# EAGLE design RowDriver4 (EAGLE 6.3)
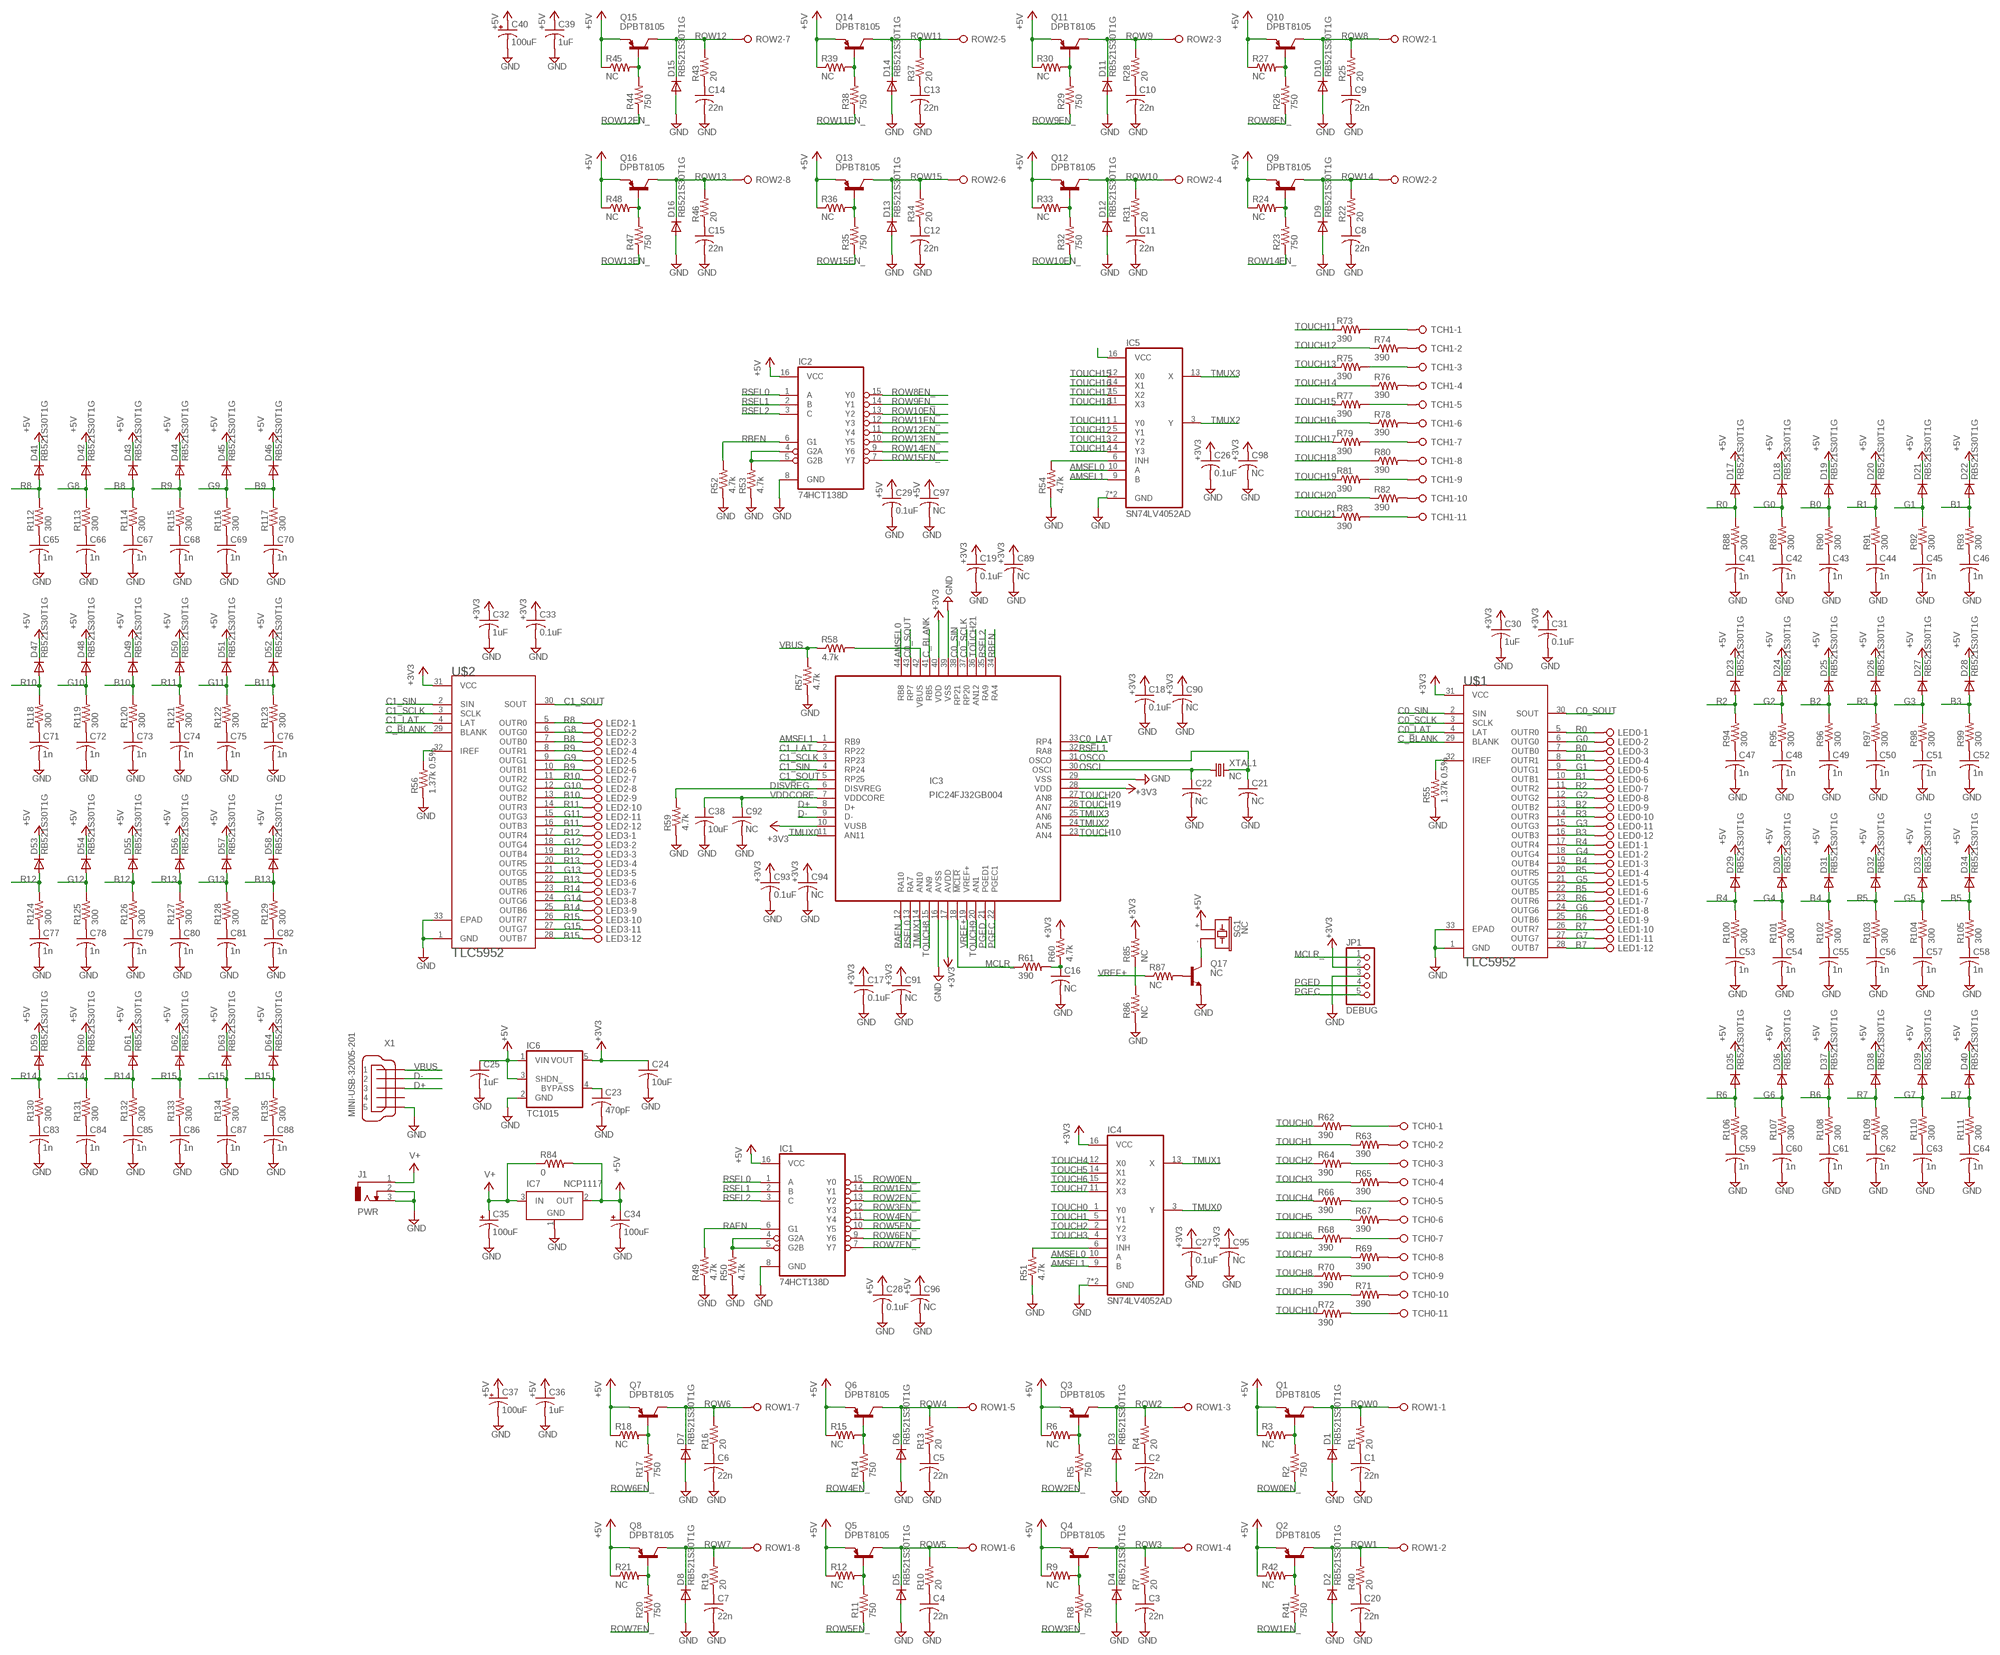
[diagram p0: schematic, sheet 1]

## Parts
C1  22n  C-USC0603  [C0603]
C2  22n  C-USC0603  [C0603]
C3  22n  C-USC0603  [C0603]
C4  22n  C-USC0603  [C0603]
C5  22n  C-USC0603  [C0603]
C6  22n  C-USC0603  [C0603]
C7  22n  C-USC0603  [C0603]
C8  22n  C-USC0603  [C0603]
C9  22n  C-USC0603  [C0603]
C10  22n  C-USC0603  [C0603]
C11  22n  C-USC0603  [C0603]
C12  22n  C-USC0603  [C0603]
C13  22n  C-USC0603  [C0603]
C14  22n  C-USC0603  [C0603]
C15  22n  C-USC0603  [C0603]
C16  NC  C-USC0805  [C0805]
C17  0.1uF  C-USC0805  [C0805]
C18  0.1uF  C-USC0805  [C0805]
C19  0.1uF  C-USC0805  [C0805]
C20  22n  C-USC0603  [C0603]
C21  NC  C-USC0805  [C0805]
C22  NC  C-USC0805  [C0805]
C23  470pF  C-USC0805  [C0805]
C24  10uF  C-USC1206K  [C1206K]
C25  1uF  C-USC0805  [C0805]
C26  0.1uF  C-USC0805  [C0805]
C27  0.1uF  C-USC0805  [C0805]
C28  0.1uF  C-USC0805  [C0805]
C29  0.1uF  C-USC0805  [C0805]
C30  1uF  C-USC0805  [C0805]
C31  0.1uF  C-USC0805  [C0805]
C32  1uF  C-USC0805  [C0805]
C33  0.1uF  C-USC0805  [C0805]
C34  100uF  CPOL-USD  [PANASONIC_D]
C35  100uF  CPOL-USD  [PANASONIC_D]
C36  1uF  C-USC0805  [C0805]
C37  100uF  CPOL-USD  [PANASONIC_D]
C38  10uF  C-USC1206K  [C1206K]
C39  1uF  C-USC0805  [C0805]
C40  100uF  CPOL-USD  [PANASONIC_D]
C41  1n  C-USC0805  [C0805]
C42  1n  C-USC0805  [C0805]
C43  1n  C-USC0805  [C0805]
C44  1n  C-USC0805  [C0805]
C45  1n  C-USC0805  [C0805]
C46  1n  C-USC0805  [C0805]
C47  1n  C-USC0805  [C0805]
C48  1n  C-USC0805  [C0805]
C49  1n  C-USC0805  [C0805]
C50  1n  C-USC0805  [C0805]
C51  1n  C-USC0805  [C0805]
C52  1n  C-USC0805  [C0805]
C53  1n  C-USC0805  [C0805]
C54  1n  C-USC0805  [C0805]
C55  1n  C-USC0805  [C0805]
C56  1n  C-USC0805  [C0805]
C57  1n  C-USC0805  [C0805]
C58  1n  C-USC0805  [C0805]
C59  1n  C-USC0805  [C0805]
C60  1n  C-USC0805  [C0805]
C61  1n  C-USC0805  [C0805]
C62  1n  C-USC0805  [C0805]
C63  1n  C-USC0805  [C0805]
C64  1n  C-USC0805  [C0805]
C65  1n  C-USC0805  [C0805]
C66  1n  C-USC0805  [C0805]
C67  1n  C-USC0805  [C0805]
C68  1n  C-USC0805  [C0805]
C69  1n  C-USC0805  [C0805]
C70  1n  C-USC0805  [C0805]
C71  1n  C-USC0805  [C0805]
C72  1n  C-USC0805  [C0805]
C73  1n  C-USC0805  [C0805]
C74  1n  C-USC0805  [C0805]
C75  1n  C-USC0805  [C0805]
C76  1n  C-USC0805  [C0805]
C77  1n  C-USC0805  [C0805]
C78  1n  C-USC0805  [C0805]
C79  1n  C-USC0805  [C0805]
C80  1n  C-USC0805  [C0805]
C81  1n  C-USC0805  [C0805]
C82  1n  C-USC0805  [C0805]
C83  1n  C-USC0805  [C0805]
C84  1n  C-USC0805  [C0805]
C85  1n  C-USC0805  [C0805]
C86  1n  C-USC0805  [C0805]
C87  1n  C-USC0805  [C0805]
C88  1n  C-USC0805  [C0805]
C89  NC  C-USC0805  [C0805]
C90  NC  C-USC0805  [C0805]
C91  NC  C-USC0805  [C0805]
C92  NC  C-USC0805  [C0805]
C93  0.1uF  C-USC0805  [C0805]
C94  NC  C-USC0805  [C0805]
C95  NC  C-USC0805  [C0805]
C96  NC  C-USC0805  [C0805]
C97  NC  C-USC0805  [C0805]
C98  NC  C-USC0805  [C0805]
D1  RB521S30T1G  DIODE-SOD523  [SOD523]
D2  RB521S30T1G  DIODE-SOD523  [SOD523]
D3  RB521S30T1G  DIODE-SOD523  [SOD523]
D4  RB521S30T1G  DIODE-SOD523  [SOD523]
D5  RB521S30T1G  DIODE-SOD523  [SOD523]
D6  RB521S30T1G  DIODE-SOD523  [SOD523]
D7  RB521S30T1G  DIODE-SOD523  [SOD523]
D8  RB521S30T1G  DIODE-SOD523  [SOD523]
D9  RB521S30T1G  DIODE-SOD523  [SOD523]
D10  RB521S30T1G  DIODE-SOD523  [SOD523]
D11  RB521S30T1G  DIODE-SOD523  [SOD523]
D12  RB521S30T1G  DIODE-SOD523  [SOD523]
D13  RB521S30T1G  DIODE-SOD523  [SOD523]
D14  RB521S30T1G  DIODE-SOD523  [SOD523]
D15  RB521S30T1G  DIODE-SOD523  [SOD523]
D16  RB521S30T1G  DIODE-SOD523  [SOD523]
D17  RB521S30T1G  DIODE-SOD523  [SOD523]
D18  RB521S30T1G  DIODE-SOD523  [SOD523]
D19  RB521S30T1G  DIODE-SOD523  [SOD523]
D20  RB521S30T1G  DIODE-SOD523  [SOD523]
D21  RB521S30T1G  DIODE-SOD523  [SOD523]
D22  RB521S30T1G  DIODE-SOD523  [SOD523]
D23  RB521S30T1G  DIODE-SOD523  [SOD523]
D24  RB521S30T1G  DIODE-SOD523  [SOD523]
D25  RB521S30T1G  DIODE-SOD523  [SOD523]
D26  RB521S30T1G  DIODE-SOD523  [SOD523]
D27  RB521S30T1G  DIODE-SOD523  [SOD523]
D28  RB521S30T1G  DIODE-SOD523  [SOD523]
D29  RB521S30T1G  DIODE-SOD523  [SOD523]
D30  RB521S30T1G  DIODE-SOD523  [SOD523]
D31  RB521S30T1G  DIODE-SOD523  [SOD523]
D32  RB521S30T1G  DIODE-SOD523  [SOD523]
D33  RB521S30T1G  DIODE-SOD523  [SOD523]
D34  RB521S30T1G  DIODE-SOD523  [SOD523]
D35  RB521S30T1G  DIODE-SOD523  [SOD523]
D36  RB521S30T1G  DIODE-SOD523  [SOD523]
D37  RB521S30T1G  DIODE-SOD523  [SOD523]
D38  RB521S30T1G  DIODE-SOD523  [SOD523]
D39  RB521S30T1G  DIODE-SOD523  [SOD523]
D40  RB521S30T1G  DIODE-SOD523  [SOD523]
D41  RB521S30T1G  DIODE-SOD523  [SOD523]
D42  RB521S30T1G  DIODE-SOD523  [SOD523]
D43  RB521S30T1G  DIODE-SOD523  [SOD523]
D44  RB521S30T1G  DIODE-SOD523  [SOD523]
D45  RB521S30T1G  DIODE-SOD523  [SOD523]
D46  RB521S30T1G  DIODE-SOD523  [SOD523]
D47  RB521S30T1G  DIODE-SOD523  [SOD523]
D48  RB521S30T1G  DIODE-SOD523  [SOD523]
D49  RB521S30T1G  DIODE-SOD523  [SOD523]
D50  RB521S30T1G  DIODE-SOD523  [SOD523]
D51  RB521S30T1G  DIODE-SOD523  [SOD523]
D52  RB521S30T1G  DIODE-SOD523  [SOD523]
D53  RB521S30T1G  DIODE-SOD523  [SOD523]
D54  RB521S30T1G  DIODE-SOD523  [SOD523]
D55  RB521S30T1G  DIODE-SOD523  [SOD523]
D56  RB521S30T1G  DIODE-SOD523  [SOD523]
D57  RB521S30T1G  DIODE-SOD523  [SOD523]
D58  RB521S30T1G  DIODE-SOD523  [SOD523]
D59  RB521S30T1G  DIODE-SOD523  [SOD523]
D60  RB521S30T1G  DIODE-SOD523  [SOD523]
D61  RB521S30T1G  DIODE-SOD523  [SOD523]
D62  RB521S30T1G  DIODE-SOD523  [SOD523]
D63  RB521S30T1G  DIODE-SOD523  [SOD523]
D64  RB521S30T1G  DIODE-SOD523  [SOD523]
IC1  74HCT138D  [SO16]
IC2  74HCT138D  [SO16]
IC3  PIC24FJ32GB004  [TQFP44]
IC4  SN74LV4052AD  [SO16]
IC5  SN74LV4052AD  [SO16]
IC6  TC1015  [SOT23-5L]
IC7  NCP1117  [SOT223]
J1  PWR  DCJ0303  [DCJ0303]
JP1  DEBUG  PINHD-1X5/90  [1X05/90]
LED0  OSTVN12A150  [OSTVN12]
LED1  OSTVN12A150  [OSTVN12]
LED2  OSTVN12A150  [OSTVN12]
LED3  OSTVN12A150  [OSTVN12]
Q1  DPBT8105  [SOT23]
Q2  DPBT8105  [SOT23]
Q3  DPBT8105  [SOT23]
Q4  DPBT8105  [SOT23]
Q5  DPBT8105  [SOT23]
Q6  DPBT8105  [SOT23]
Q7  DPBT8105  [SOT23]
Q8  DPBT8105  [SOT23]
Q9  DPBT8105  [SOT23]
Q10  DPBT8105  [SOT23]
Q11  DPBT8105  [SOT23]
Q12  DPBT8105  [SOT23]
Q13  DPBT8105  [SOT23]
Q14  DPBT8105  [SOT23]
Q15  DPBT8105  [SOT23]
Q16  DPBT8105  [SOT23]
Q17  NC  -NPN-SOT23-EBC  [SOT23-EBC]
R1  20  R-US_R0603  [R0603]
R2  750  R-US_R0603  [R0603]
R3  NC  R-US_R0603  [R0603]
R4  20  R-US_R0603  [R0603]
R5  750  R-US_R0603  [R0603]
R6  NC  R-US_R0603  [R0603]
R7  20  R-US_R0603  [R0603]
R8  750  R-US_R0603  [R0603]
R9  NC  R-US_R0603  [R0603]
R10  20  R-US_R0603  [R0603]
R11  750  R-US_R0603  [R0603]
R12  NC  R-US_R0603  [R0603]
R13  20  R-US_R0603  [R0603]
R14  750  R-US_R0603  [R0603]
R15  NC  R-US_R0603  [R0603]
R16  20  R-US_R0603  [R0603]
R17  750  R-US_R0603  [R0603]
R18  NC  R-US_R0603  [R0603]
R19  20  R-US_R0603  [R0603]
R20  750  R-US_R0603  [R0603]
R21  NC  R-US_R0603  [R0603]
R22  20  R-US_R0603  [R0603]
R23  750  R-US_R0603  [R0603]
R24  NC  R-US_R0603  [R0603]
R25  20  R-US_R0603  [R0603]
R26  750  R-US_R0603  [R0603]
R27  NC  R-US_R0603  [R0603]
R28  20  R-US_R0603  [R0603]
R29  750  R-US_R0603  [R0603]
R30  NC  R-US_R0603  [R0603]
R31  20  R-US_R0603  [R0603]
R32  750  R-US_R0603  [R0603]
R33  NC  R-US_R0603  [R0603]
R34  20  R-US_R0603  [R0603]
R35  750  R-US_R0603  [R0603]
R36  NC  R-US_R0603  [R0603]
R37  20  R-US_R0603  [R0603]
R38  750  R-US_R0603  [R0603]
R39  NC  R-US_R0603  [R0603]
R40  20  R-US_R0603  [R0603]
R41  750  R-US_R0603  [R0603]
R42  NC  R-US_R0603  [R0603]
R43  20  R-US_R0603  [R0603]
R44  750  R-US_R0603  [R0603]
R45  NC  R-US_R0603  [R0603]
R46  20  R-US_R0603  [R0603]
R47  750  R-US_R0603  [R0603]
R48  NC  R-US_R0603  [R0603]
R49  4.7k  R-US_R0805  [R0805]
R50  4.7k  R-US_R0805  [R0805]
R51  4.7k  R-US_R0805  [R0805]
R52  4.7k  R-US_R0805  [R0805]
R53  4.7k  R-US_R0805  [R0805]
R54  4.7k  R-US_R0805  [R0805]
R55  1.37k 0.5%  R-US_R0805  [R0805]
R56  1.37k 0.5%  R-US_R0805  [R0805]
R57  4.7k  R-US_R0805  [R0805]
R58  4.7k  R-US_R0805  [R0805]
R59  4.7k  R-US_R0805  [R0805]
R60  4.7k  R-US_R0805  [R0805]
R61  390  R-US_R0805  [R0805]
R62  390  R-US_R0805  [R0805]
R63  390  R-US_R0805  [R0805]
R64  390  R-US_R0805  [R0805]
R65  390  R-US_R0805  [R0805]
R66  390  R-US_R0805  [R0805]
R67  390  R-US_R0805  [R0805]
R68  390  R-US_R0805  [R0805]
R69  390  R-US_R0805  [R0805]
R70  390  R-US_R0805  [R0805]
R71  390  R-US_R0805  [R0805]
R72  390  R-US_R0805  [R0805]
R73  390  R-US_R0805  [R0805]
R74  390  R-US_R0805  [R0805]
R75  390  R-US_R0805  [R0805]
R76  390  R-US_R0805  [R0805]
R77  390  R-US_R0805  [R0805]
R78  390  R-US_R0805  [R0805]
R79  390  R-US_R0805  [R0805]
R80  390  R-US_R0805  [R0805]
R81  390  R-US_R0805  [R0805]
R82  390  R-US_R0805  [R0805]
R83  390  R-US_R0805  [R0805]
R84  0  R-US_R0805  [R0805]
R85  NC  R-US_R0805  [R0805]
R86  NC  R-US_R0805  [R0805]
R87  NC  R-US_R0805  [R0805]
R88  300  R-US_R0805  [R0805]
R89  300  R-US_R0805  [R0805]
R90  300  R-US_R0805  [R0805]
R91  300  R-US_R0805  [R0805]
R92  300  R-US_R0805  [R0805]
R93  300  R-US_R0805  [R0805]
R94  300  R-US_R0805  [R0805]
R95  300  R-US_R0805  [R0805]
R96  300  R-US_R0805  [R0805]
R97  300  R-US_R0805  [R0805]
R98  300  R-US_R0805  [R0805]
R99  300  R-US_R0805  [R0805]
R100  300  R-US_R0805  [R0805]
R101  300  R-US_R0805  [R0805]
R102  300  R-US_R0805  [R0805]
R103  300  R-US_R0805  [R0805]
R104  300  R-US_R0805  [R0805]
R105  300  R-US_R0805  [R0805]
R106  300  R-US_R0805  [R0805]
R107  300  R-US_R0805  [R0805]
R108  300  R-US_R0805  [R0805]
R109  300  R-US_R0805  [R0805]
R110  300  R-US_R0805  [R0805]
R111  300  R-US_R0805  [R0805]
R112  300  R-US_R0805  [R0805]
R113  300  R-US_R0805  [R0805]
R114  300  R-US_R0805  [R0805]
R115  300  R-US_R0805  [R0805]
R116  300  R-US_R0805  [R0805]
R117  300  R-US_R0805  [R0805]
R118  300  R-US_R0805  [R0805]
R119  300  R-US_R0805  [R0805]
R120  300  R-US_R0805  [R0805]
R121  300  R-US_R0805  [R0805]
R122  300  R-US_R0805  [R0805]
R123  300  R-US_R0805  [R0805]
R124  300  R-US_R0805  [R0805]
R125  300  R-US_R0805  [R0805]
R126  300  R-US_R0805  [R0805]
R127  300  R-US_R0805  [R0805]
R128  300  R-US_R0805  [R0805]
R129  300  R-US_R0805  [R0805]
R130  300  R-US_R0805  [R0805]
R131  300  R-US_R0805  [R0805]
R132  300  R-US_R0805  [R0805]
R133  300  R-US_R0805  [R0805]
R134  300  R-US_R0805  [R0805]
R135  300  R-US_R0805  [R0805]
ROW1  OSTVN08A150  [OSTVN08]
ROW2  OSTVN08A150  [OSTVN08]
SG1  NC  F/CM04P  [F/CM04P]
TCH0  OSTVN11A150  [OSTVN11]
TCH1  OSTVN11A150  [OSTVN11]
U$1  TLC5952  [HTSSOP-32POWERPAD]
U$2  TLC5952  [HTSSOP-32POWERPAD]
X1  MINI-USB-32005-201  [32005-201]
XTAL1  NC  CRYSTALHC49UP  [HC49UP]

## Nets
+3V3: C17.1 C18.1 C19.1 C24.1 C26.1 C27.1 C30.1 C31.1 C32.1 C33.1 C89.1 C90.1 C91.1 C93.1 C94.1 C95.1 C98.1 IC3.10(VUSB) IC3.17(AVDD) IC3.28(VDD) IC3.40(VDD) IC4.16(VCC) IC5.16(VCC) IC6.5(VOUT) JP1.2 R60.2 R85.2 U$1.31(VCC) U$2.31(VCC)
+5V: C25.1 C28.1 C29.1 C34.+ C36.1 C37.+ C39.1 C40.+ C96.1 C97.1 D17.C D18.C D19.C D20.C D21.C D22.C D23.C D24.C D25.C D26.C D27.C D28.C D29.C D30.C D31.C D32.C D33.C D34.C D35.C D36.C D37.C D38.C D39.C D40.C D41.C D42.C D43.C D44.C D45.C D46.C D47.C D48.C D49.C D50.C D51.C D52.C D53.C D54.C D55.C D56.C D57.C D58.C D59.C D60.C D61.C D62.C D63.C D64.C IC1.16(VCC) IC2.16(VCC) IC6.1(VIN) IC6.3(SHDN_) IC7.2(OUT) Q1.2(E) Q2.2(E) Q3.2(E) Q4.2(E) Q5.2(E) Q6.2(E) Q7.2(E) Q8.2(E) Q9.2(E) Q10.2(E) Q11.2(E) Q12.2(E) Q13.2(E) Q14.2(E) Q15.2(E) Q16.2(E) R3.1 R6.1 R9.1 R12.1 R15.1 R18.1 R21.1 R24.1 R27.1 R30.1 R33.1 R36.1 R39.1 R42.1 R45.1 R48.1 R84.2 SG1.+
AMSEL0: IC3.44(RB8) IC4.10(A) IC5.10(A)
AMSEL1: IC3.1(RB9) IC4.9(B) IC5.9(B)
B0: D19.A LED0.3 R90.2 U$1.7(OUTB0)
B1: D22.A LED0.6 R93.2 U$1.10(OUTB1)
B2: D25.A LED0.9 R96.2 U$1.13(OUTB2)
B3: D28.A LED0.12 R99.2 U$1.16(OUTB3)
B4: D31.A LED1.3 R102.2 U$1.19(OUTB4)
B5: D34.A LED1.6 R105.2 U$1.22(OUTB5)
B6: D37.A LED1.9 R108.2 U$1.25(OUTB6)
B7: D40.A LED1.12 R111.2 U$1.28(OUTB7)
B8: D43.A LED2.3 R114.2 U$2.7(OUTB0)
B9: D46.A LED2.6 R117.2 U$2.10(OUTB1)
B10: D49.A LED2.9 R120.2 U$2.13(OUTB2)
B11: D52.A LED2.12 R123.2 U$2.16(OUTB3)
B12: D55.A LED3.3 R126.2 U$2.19(OUTB4)
B13: D58.A LED3.6 R129.2 U$2.22(OUTB5)
B14: D61.A LED3.9 R132.2 U$2.25(OUTB6)
B15: D64.A LED3.12 R135.2 U$2.28(OUTB7)
C0_LAT: IC3.33(RP4) U$1.4(LAT)
C0_SCLK: IC3.37(RP20) U$1.3(SCLK)
C0_SIN: IC3.38(RP21) U$1.2(SIN)
C0_SOUT: IC3.43(RP7) U$1.30(SOUT)
C1_LAT: IC3.2(RP22) U$2.4(LAT)
C1_SCLK: IC3.3(RP23) U$2.3(SCLK)
C1_SIN: IC3.4(RP24) U$2.2(SIN)
C1_SOUT: IC3.5(RP25) U$2.30(SOUT)
C_BLANK: IC3.41(RB5) U$1.29(BLANK) U$2.29(BLANK)
CAIREF: R55.2 U$1.32(IREF)
CAIREF1: R56.2 U$2.32(IREF)
D+: IC3.8(D+) X1.3
D-: IC3.9(D-) X1.2
DISVREG: IC3.6(DISVREG) R59.2
G0: D18.A LED0.2 R89.2 U$1.6(OUTG0)
G1: D21.A LED0.5 R92.2 U$1.9(OUTG1)
G2: D24.A LED0.8 R95.2 U$1.12(OUTG2)
G3: D27.A LED0.11 R98.2 U$1.15(OUTG3)
G4: D30.A LED1.2 R101.2 U$1.18(OUTG4)
G5: D33.A LED1.5 R104.2 U$1.21(OUTG5)
G6: D36.A LED1.8 R107.2 U$1.24(OUTG6)
G7: D39.A LED1.11 R110.2 U$1.27(OUTG7)
G8: D42.A LED2.2 R113.2 U$2.6(OUTG0)
G9: D45.A LED2.5 R116.2 U$2.9(OUTG1)
G10: D48.A LED2.8 R119.2 U$2.12(OUTG2)
G11: D51.A LED2.11 R122.2 U$2.15(OUTG3)
G12: D54.A LED3.2 R125.2 U$2.18(OUTG4)
G13: D57.A LED3.5 R128.2 U$2.21(OUTG5)
G14: D60.A LED3.8 R131.2 U$2.24(OUTG6)
G15: D63.A LED3.11 R134.2 U$2.27(OUTG7)
GND: C1.2 C2.2 C3.2 C4.2 C5.2 C6.2 C7.2 C8.2 C9.2 C10.2 C11.2 C12.2 C13.2 C14.2 C15.2 C16.2 C17.2 C18.2 C19.2 C20.2 C21.2 C22.2 C23.2 C24.2 C25.2 C26.2 C27.2 C28.2 C29.2 C30.2 C31.2 C32.2 C33.2 C34.- C35.- C36.2 C37.- C38.2 C39.2 C40.- C41.2 C42.2 C43.2 C44.2 C45.2 C46.2 C47.2 C48.2 C49.2 C50.2 C51.2 C52.2 C53.2 C54.2 C55.2 C56.2 C57.2 C58.2 C59.2 C60.2 C61.2 C62.2 C63.2 C64.2 C65.2 C66.2 C67.2 C68.2 C69.2 C70.2 C71.2 C72.2 C73.2 C74.2 C75.2 C76.2 C77.2 C78.2 C79.2 C80.2 C81.2 C82.2 C83.2 C84.2 C85.2 C86.2 C87.2 C88.2 C89.2 C90.2 C91.2 C92.2 C93.2 C94.2 C95.2 C96.2 C97.2 C98.2 D1.A D2.A D3.A D4.A D5.A D6.A D7.A D8.A D9.A D10.A D11.A D12.A D13.A D14.A D15.A D16.A IC1.8(GND) IC2.8(GND) IC3.16(AVSS) IC3.29(VSS) IC3.39(VSS) IC4.7(GND) IC4.8(GND) IC5.7(GND) IC5.8(GND) IC6.2(GND) IC7.1(GND) J1.2 J1.3 JP1.3 Q17.E R49.1 R50.1 R51.1 R52.1 R53.1 R54.1 R55.1 R56.1 R57.1 R59.1 R86.1 U$1.1(GND) U$1.33(EPAD) U$2.1(GND) U$2.33(EPAD) X1.5
MCLR_: IC3.18(!MCLR) JP1.1 R61.1
N$1: Q1.1(B) R2.2 R3.2
N$2: C1.1 R1.1
N$3: Q3.1(B) R5.2 R6.2
N$4: C2.1 R4.1
N$5: Q4.1(B) R8.2 R9.2
N$6: C3.1 R7.1
N$7: Q5.1(B) R11.2 R12.2
N$8: C4.1 R10.1
N$9: Q6.1(B) R14.2 R15.2
N$10: C5.1 R13.1
N$11: Q7.1(B) R17.2 R18.2
N$12: C6.1 R16.1
N$13: Q8.1(B) R20.2 R21.2
N$14: C7.1 R19.1
N$15: Q9.1(B) R23.2 R24.2
N$16: C8.1 R22.1
N$17: Q10.1(B) R26.2 R27.2
N$18: C9.1 R25.1
N$19: Q11.1(B) R29.2 R30.2
N$20: C10.1 R28.1
N$21: Q12.1(B) R32.2 R33.2
N$22: C11.1 R31.1
N$23: Q13.1(B) R35.2 R36.2
N$24: C12.1 R34.1
N$25: Q14.1(B) R38.2 R39.2
N$26: C13.1 R37.1
N$27: Q15.1(B) R44.2 R45.2
N$28: C14.1 R43.1
N$29: Q16.1(B) R47.2 R48.2
N$30: C15.1 R46.1
N$33: Q2.1(B) R41.2 R42.2
N$34: C20.1 R40.1
N$41: IC1.4(G2A) IC1.5(G2B) R50.2
N$42: IC4.6(INH) R51.2
N$43: IC2.4(G2A) IC2.5(G2B) R53.2
N$44: IC5.6(INH) R54.2
N$45: IC3.42(VBUS) R58.2
N$46: C16.1 R60.1 R61.2
N$47: R62.2 TCH0.1
N$48: R63.2 TCH0.2
N$65: R64.2 TCH0.3
N$66: R65.2 TCH0.4
N$67: R66.2 TCH0.5
N$68: R67.2 TCH0.6
N$69: R68.2 TCH0.7
N$70: R69.2 TCH0.8
N$71: R70.2 TCH0.9
N$72: R71.2 TCH0.10
N$73: R72.2 TCH0.11
N$74: R74.2 TCH1.2
N$75: R76.2 TCH1.4
N$76: R78.2 TCH1.6
N$77: R80.2 TCH1.8
N$78: R82.2 TCH1.10
N$79: R73.2 TCH1.1
N$80: R75.2 TCH1.3
N$81: R77.2 TCH1.5
N$82: R79.2 TCH1.7
N$83: R81.2 TCH1.9
N$84: R83.2 TCH1.11
N$85: C23.1 IC6.4(BYPASS)
N$86: R85.1 R86.2
N$87: Q17.B R87.2
N$88: Q17.C SG1.-
N$89: C41.1 R88.1
N$90: C42.1 R89.1
N$91: C43.1 R90.1
N$92: C44.1 R91.1
N$93: C45.1 R92.1
N$94: C46.1 R93.1
N$95: C47.1 R94.1
N$96: C48.1 R95.1
N$97: C49.1 R96.1
N$98: C50.1 R97.1
N$99: C51.1 R98.1
N$100: C52.1 R99.1
N$101: C53.1 R100.1
N$102: C54.1 R101.1
N$103: C55.1 R102.1
N$104: C56.1 R103.1
N$105: C57.1 R104.1
N$106: C58.1 R105.1
N$107: C59.1 R106.1
N$108: C60.1 R107.1
N$109: C61.1 R108.1
N$110: C62.1 R109.1
N$111: C63.1 R110.1
N$112: C64.1 R111.1
N$114: C65.1 R112.1
N$116: C66.1 R113.1
N$118: C67.1 R114.1
N$120: C68.1 R115.1
N$122: C69.1 R116.1
N$124: C70.1 R117.1
N$126: C71.1 R118.1
N$128: C72.1 R119.1
N$130: C73.1 R120.1
N$132: C74.1 R121.1
N$134: C75.1 R122.1
N$136: C76.1 R123.1
N$138: C77.1 R124.1
N$140: C78.1 R125.1
N$142: C79.1 R126.1
N$144: C80.1 R127.1
N$146: C81.1 R128.1
N$148: C82.1 R129.1
N$150: C83.1 R130.1
N$152: C84.1 R131.1
N$154: C85.1 R132.1
N$156: C86.1 R133.1
N$158: C87.1 R134.1
N$160: C88.1 R135.1
OSCI: C22.1 IC3.30(OSCI) XTAL1.1
OSCO: C21.1 IC3.31(OSCO) XTAL1.2
PGEC: IC3.22(PGEC1) JP1.5
PGED: IC3.21(PGED1) JP1.4
R0: D17.A LED0.1 R88.2 U$1.5(OUTR0)
R1: D20.A LED0.4 R91.2 U$1.8(OUTR1)
R2: D23.A LED0.7 R94.2 U$1.11(OUTR2)
R3: D26.A LED0.10 R97.2 U$1.14(OUTR3)
R4: D29.A LED1.1 R100.2 U$1.17(OUTR4)
R5: D32.A LED1.4 R103.2 U$1.20(OUTR5)
R6: D35.A LED1.7 R106.2 U$1.23(OUTR6)
R7: D38.A LED1.10 R109.2 U$1.26(OUTR7)
R8: D41.A LED2.1 R112.2 U$2.5(OUTR0)
R9: D44.A LED2.4 R115.2 U$2.8(OUTR1)
R10: D47.A LED2.7 R118.2 U$2.11(OUTR2)
R11: D50.A LED2.10 R121.2 U$2.14(OUTR3)
R12: D53.A LED3.1 R124.2 U$2.17(OUTR4)
R13: D56.A LED3.4 R127.2 U$2.20(OUTR5)
R14: D59.A LED3.7 R130.2 U$2.23(OUTR6)
R15: D62.A LED3.10 R133.2 U$2.26(OUTR7)
RAEN: IC1.6(G1) IC3.12(RA10) R49.2
RBEN: IC2.6(G1) IC3.34(RA4) R52.2
ROW0: D1.C Q1.3(C) R1.2 ROW1.1
ROW0EN_: IC1.15(Y0) R2.1
ROW1: D2.C Q2.3(C) R40.2 ROW1.2
ROW1EN_: IC1.14(Y1) R41.1
ROW2: D3.C Q3.3(C) R4.2 ROW1.3
ROW2EN_: IC1.13(Y2) R5.1
ROW3: D4.C Q4.3(C) R7.2 ROW1.4
ROW3EN_: IC1.12(Y3) R8.1
ROW4: D6.C Q6.3(C) R13.2 ROW1.5
ROW4EN_: IC1.11(Y4) R14.1
ROW5: D5.C Q5.3(C) R10.2 ROW1.6
ROW5EN_: IC1.10(Y5) R11.1
ROW6: D7.C Q7.3(C) R16.2 ROW1.7
ROW6EN_: IC1.9(Y6) R17.1
ROW7: D8.C Q8.3(C) R19.2 ROW1.8
ROW7EN_: IC1.7(Y7) R20.1
ROW8: D10.C Q10.3(C) R25.2 ROW2.1
ROW8EN_: IC2.15(Y0) R26.1
ROW9: D11.C Q11.3(C) R28.2 ROW2.3
ROW9EN_: IC2.14(Y1) R29.1
ROW10: D12.C Q12.3(C) R31.2 ROW2.4
ROW10EN_: IC2.13(Y2) R32.1
ROW11: D14.C Q14.3(C) R37.2 ROW2.5
ROW11EN_: IC2.12(Y3) R38.1
ROW12: D15.C Q15.3(C) R43.2 ROW2.7
ROW12EN_: IC2.11(Y4) R44.1
ROW13: D16.C Q16.3(C) R46.2 ROW2.8
ROW13EN_: IC2.10(Y5) R47.1
ROW14: D9.C Q9.3(C) R22.2 ROW2.2
ROW14EN_: IC2.9(Y6) R23.1
ROW15: D13.C Q13.3(C) R34.2 ROW2.6
ROW15EN_: IC2.7(Y7) R35.1
RSEL0: IC1.1(A) IC2.1(A) IC3.13(RA7)
RSEL1: IC1.2(B) IC2.2(B) IC3.32(RA8)
RSEL2: IC1.3(C) IC2.3(C) IC3.35(RA9)
TMUX0: IC3.11(AN11) IC4.3(Y)
TMUX1: IC3.14(AN10) IC4.13(X)
TMUX2: IC3.24(AN5) IC5.3(Y)
TMUX3: IC3.25(AN6) IC5.13(X)
TOUCH0: IC4.1(Y0) R62.1
TOUCH1: IC4.5(Y1) R63.1
TOUCH2: IC4.2(Y2) R64.1
TOUCH3: IC4.4(Y3) R65.1
TOUCH4: IC4.12(X0) R66.1
TOUCH5: IC4.14(X1) R67.1
TOUCH6: IC4.15(X2) R68.1
TOUCH7: IC4.11(X3) R69.1
TOUCH8: IC3.15(AN9) R70.1
TOUCH9: IC3.20(AN1) R71.1
TOUCH10: IC3.23(AN4) R72.1
TOUCH11: IC5.1(Y0) R73.1
TOUCH12: IC5.5(Y1) R74.1
TOUCH13: IC5.2(Y2) R75.1
TOUCH14: IC5.4(Y3) R76.1
TOUCH15: IC5.12(X0) R77.1
TOUCH16: IC5.14(X1) R78.1
TOUCH17: IC5.15(X2) R79.1
TOUCH18: IC5.11(X3) R80.1
TOUCH19: IC3.26(AN7) R81.1
TOUCH20: IC3.27(AN8) R82.1
TOUCH21: IC3.36(AN12) R83.1
V+: C35.+ IC7.3(IN) J1.1 R84.1
VBUS: R57.2 R58.1 X1.1
VDDCORE: C38.1 C92.1 IC3.7(VDDCORE)
VREF+: IC3.19(VREF+) R87.1
Unconnected: X1.4

## Power pins joined to a net without a drawn wire
GND: IC7.4(GND)

## Library data of the parts
C1-C15 C20 C41-C88 = resistor:C-US: CAPACITOR, American symbol
C16-C19 C21-C33 C36 C38 C39 C89-C98 = rcl:C-US: CAPACITOR, American symbol
C34 C35 C37 C40 = resistor:CPOL-US: POLARIZED CAPACITOR, American symbol
D1-D64 = diode:DIODE-: DIODE
IC1 IC2 = Parts:74*138: 3-line to 8-line DECODER/DEMULTIPLEXER
IC3 = Parts:PIC24FJ32GB004: PIC24FJ32GB004 edit this description Auto generated by make-symbol-device-package-bsdl.ulp Rev. 25 Source: PIC24FJ32GB004.bsd; MPN: PIC24FJ32GB004-E/PT; OC_FARNELL: 1332295; OC_NEWARK: 98M1915
IC4 IC5 = Parts:SN74LV4052A: Dual 4-channel ANALOG MULTIPLEXER
IC6 = Parts:TC1015: 3.3V 100mA LDO from Microchip http://ww1.microchip.com/downloads/en/DeviceDoc/21335e.pdf
IC7 = Parts:NCP1117: VOLTAGE REGULATOR with shutdown; MPN: NCP1117
J1 = con-jack:DCJ0303: DC POWER JACK Source: DCJ0303.pdf; OC_FARNELL: unknown; OC_NEWARK: unknown
JP1 = pinhead:PINHD-1X5: PIN HEADER
LED0 LED1-LED3 = Parts:OSTVN12A150: OSTVN12A150 0.1" Screw Terminal, 12 Position On Shore Technology, Inc.
Q1-Q16 = Parts:DPBT8105: DPBT8105 1A PNP SURFACE MOUNT TRANSISTOR
Q17 = transistor:*-NPN-: NPN Transistror BF959 corrected 2008.03.06
R1-R135 = resistor:R-US_: RESISTOR, American symbol
ROW1 ROW2 = Parts:OSTVN08A150: OSTVN08A150 0.1" Screw Terminal, 8 Position On Shore Technology, Inc.
SG1 = buzzer:F/CM04P: BUZZER Source: Buerklin; OC_FARNELL: unknown; OC_NEWARK: unknown
TCH0 TCH1 = Parts:OSTVN11A150: OSTVN11A150 0.1" Screw Terminal, 11 Position On Shore Technology, Inc.
U$1 U$2 = Parts:TLC5952
X1 = Parts:MINI-USB-: MINI USB-B Conector Source: www.cypressindustries.com; OC_FARNELL: unknown; OC_NEWARK: unknown
XTAL1 = crystal:CRYSTAL: CRYSTAL; OC_FARNELL: unknown; OC_NEWARK: unknown

## Board
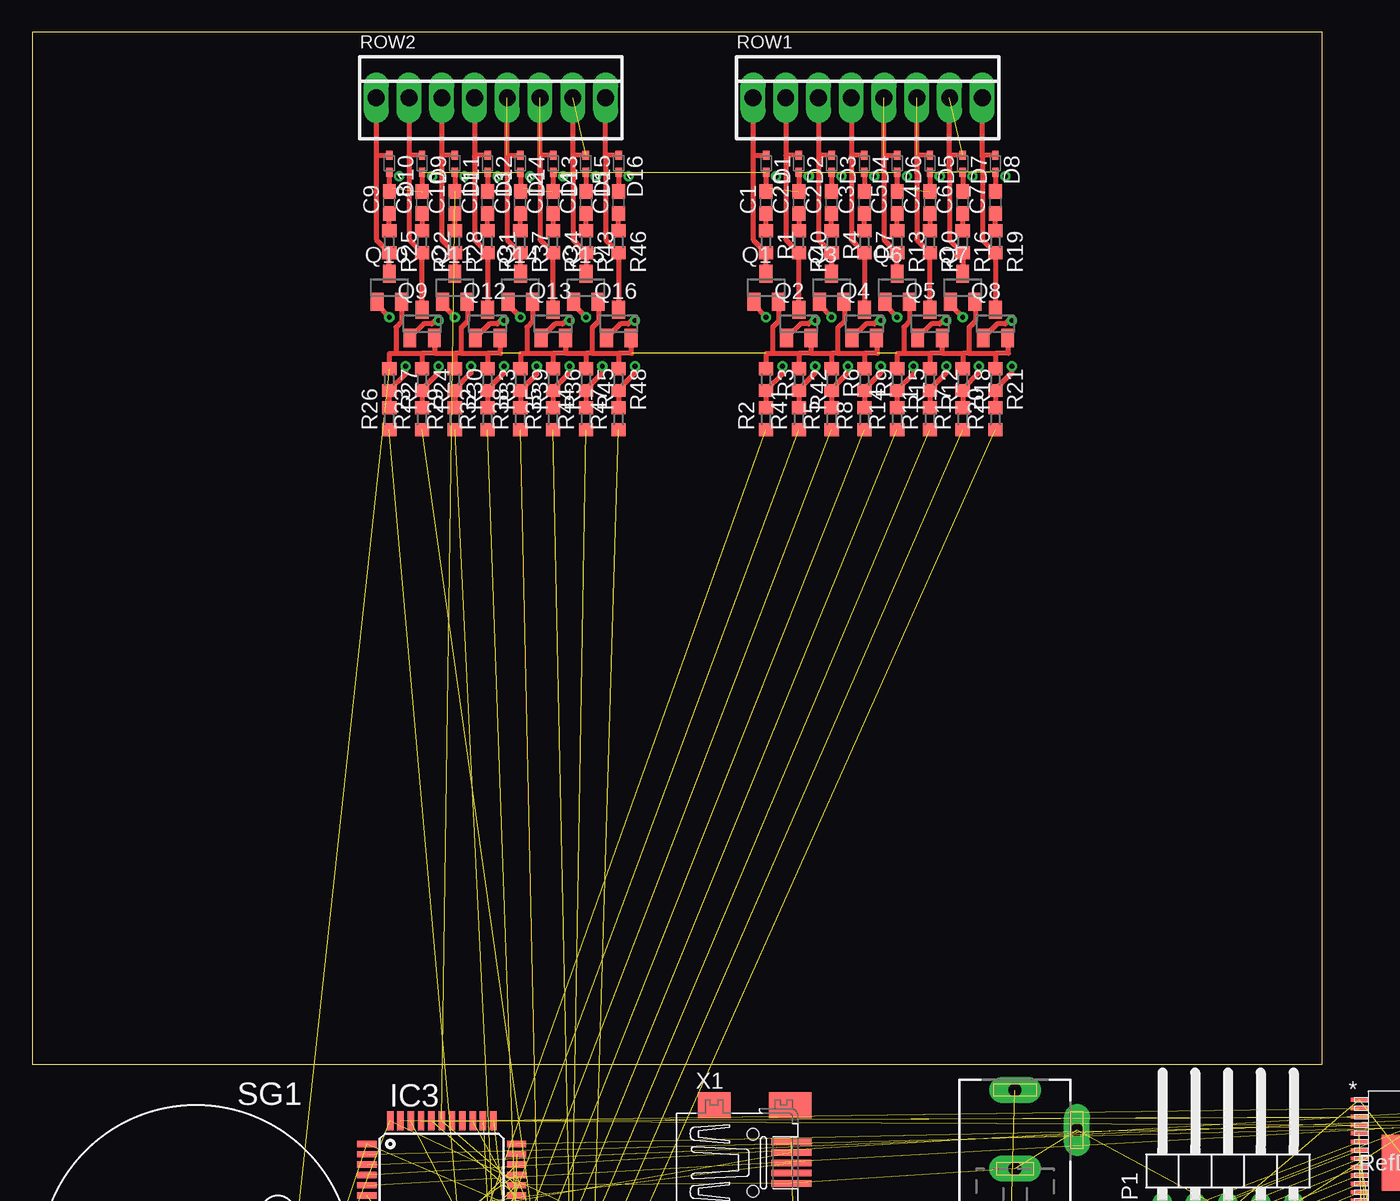
[diagram p1: board, top side]
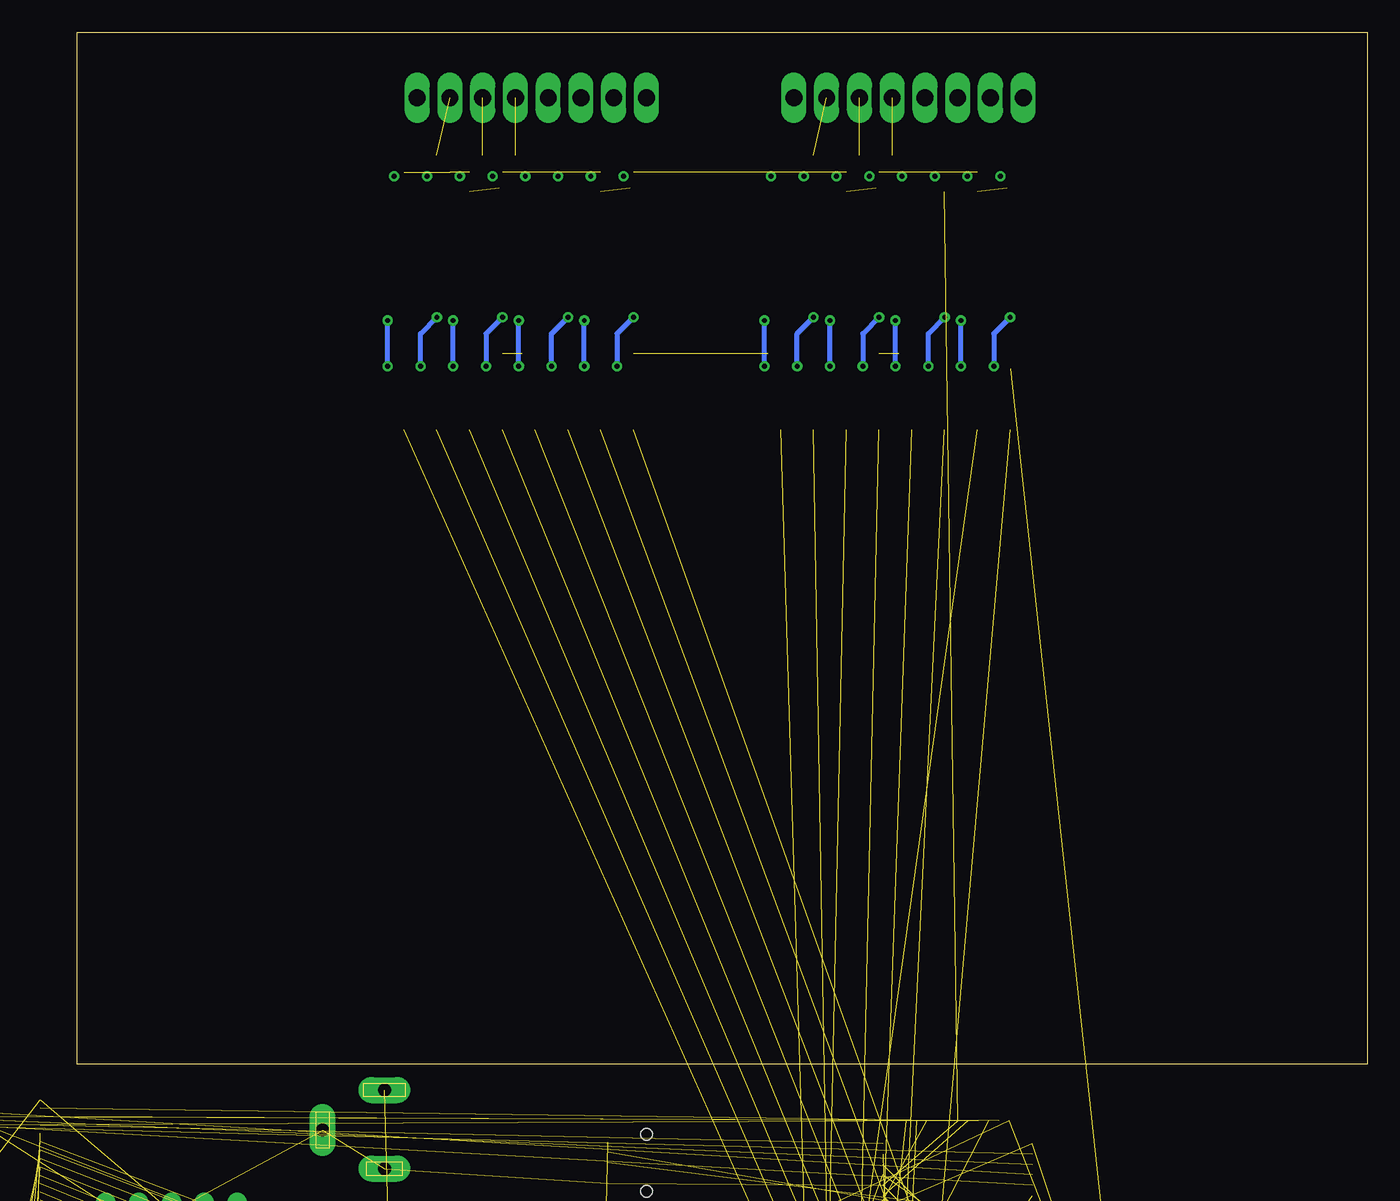
[diagram p2: board, bottom side, seen from below]

Size 100 x 80 mm. Coordinates in mm from the lower left corner, seen from the top.
Outline: 0,0 100,0 100,80 0,80 0,0
Copper layers (1*16): Top 0.035mm / dielectric 1.5mm / Bottom 0.035mm
Design rules "default": minimum track width 10mil, minimum drill 24mil, track to track 8mil, track to pad 8mil, pad to pad 8mil, via to via 8mil, smd to smd 8mil, copper to edge 40mil, drill to drill 8mil, minimum pad ring 10mil, minimum via ring 8mil, stop-mask expansion 4mil, vias tented up to drill 0mil, thermal gap 10mil

### Footprints (pad centres in the part's own frame; a part is rotated, then mirrored left to right if it is on the bottom)
C0603 = smd 1.1 x 1: 1 -0.85,0; 2 0.85,0
C0805 = smd 1.3 x 1.5: 1 -0.95,0; 2 0.95,0
C1206K = smd 1.5 x 2: 1 -1.5,0; 2 1.5,0
PANASONIC_D = smd 3 x 1.4: + 2.4,0; - -2.4,0
C0805' = smd 1.3 x 1.5: 1 -0.85,0; 2 0.85,0
SOD523 = smd 0.7 x 0.5: A 0.7,0; C -0.6,0
SO16 = smd 0.66 x 2.032: 1 -4.445,-3.073; 2 -3.175,-3.073; 3 -1.905,-3.073; 4 -0.635,-3.073; 5 0.635,-3.073; 6 1.905,-3.073; 7 3.175,-3.073; 8 4.445,-3.073; 9 4.445,3.073; 10 3.175,3.073; 11 1.905,3.073; 12 0.635,3.073; 13 -0.635,3.073; 14 -1.905,3.073; 15 -3.175,3.073; 16 -4.445,3.073
TQFP44 = smd 1.5 x 0.5: 1 -5.8,4; 2 -5.8,3.2; 3 -5.8,2.4; 4 -5.8,1.6; 5 -5.8,0.8; 6 -5.8,0; 7 -5.8,-0.8; 8 -5.8,-1.6; 9 -5.8,-2.4; 10 -5.8,-3.2; 11 -5.8,-4; 23 5.8,-4; 24 5.8,-3.2; 25 5.8,-2.4; 26 5.8,-1.6; 27 5.8,-0.8; 28 5.8,0; 29 5.8,0.8; 30 5.8,1.6; 31 5.8,2.4; 32 5.8,3.2; 33 5.8,4 | smd 0.5 x 1.5: 12 -4,-5.8; 13 -3.2,-5.8; 14 -2.4,-5.8; 15 -1.6,-5.8; 16 -0.8,-5.8; 17 0,-5.8; 18 0.8,-5.8; 19 1.6,-5.8; 20 2.4,-5.8; 21 3.2,-5.8; 22 4,-5.8; 34 4,5.8; 35 3.2,5.8; 36 2.4,5.8; 37 1.6,5.8; 38 0.8,5.8; 39 0,5.8; 40 -0.8,5.8; 41 -1.6,5.8; 42 -2.4,5.8; 43 -3.2,5.8; 44 -4,5.8
SOT23-5L = smd 0.55 x 1.2: 1 -0.95,-1.3; 2 0,-1.3; 3 0.95,-1.3; 4 0.95,1.3; 5 -0.95,1.3
SOT223 = smd 1.219 x 2.235: 1 -2.311,-3.099; 2 0,-3.099; 3 2.311,-3.099 | smd 3.6 x 2.2: 4 0,3.099
DCJ0303 = drill 1 pad 2 long: 1 0,3.1; 2 4.8,0; 3 0,-3
1X05/90 = drill 1.016 long: 1 -5.08,-3.81; 2 -2.54,-3.81; 3 0,-3.81; 4 2.54,-3.81; 5 5.08,-3.81
OSTVN12 = drill 1.3 long: 1 -13.97,0; 2 -11.43,0; 3 -8.89,0; 4 -6.35,0; 5 -3.81,0; 6 -1.27,0; 7 1.27,0; 8 3.81,0; 9 6.35,0; 10 8.89,0; 11 11.43,0; 12 13.97,0
SOT23 = smd 1 x 1.4: 1 -0.95,-1.1; 2 0.95,-1.1; 3 0,1.1
SOT23-EBC = smd 1 x 1.4: B 0.95,-1.1; C 0,1.1; E -0.95,-1.1
R0603 = smd 1 x 1.1: 1 -0.85,0; 2 0.85,0
R0805 = smd 1.3 x 1.5: 1 -0.85,0; 2 0.85,0
OSTVN08 = drill 1.3 long: 1 -8.89,0; 2 -6.35,0; 3 -3.81,0; 4 -1.27,0; 5 1.27,0; 6 3.81,0; 7 6.35,0; 8 8.89,0
F/CM04P = drill 1.016 pad 2.54 octagon: + 7.493,0; - -7.493,0
OSTVN11 = drill 1.3 long: 1 -12.7,0; 2 -10.16,0; 3 -7.62,0; 4 -5.08,0; 5 -2.54,0; 6 0,0; 7 2.54,0; 8 5.08,0; 9 7.62,0; 10 10.16,0; 11 12.7,0
HTSSOP-32POWERPAD = smd 1.27 x 0.305: 1 -3.81,4.877; 2 -3.81,4.216; 3 -3.81,3.581; 4 -3.81,2.921; 5 -3.81,2.286; 6 -3.81,1.626; 7 -3.81,0.965; 8 -3.81,0.33; 9 -3.81,-0.33; 10 -3.81,-0.965; 11 -3.81,-1.626; 12 -3.81,-2.286; 13 -3.81,-2.921; 14 -3.81,-3.581; 15 -3.81,-4.216; 16 -3.81,-4.877; 17 3.81,-4.877; 18 3.81,-4.216; 19 3.81,-3.581; 20 3.81,-2.921; 21 3.81,-2.286; 22 3.81,-1.626; 23 3.81,-0.965; 24 3.81,-0.33; 25 3.81,0.33; 26 3.81,0.965; 27 3.81,1.626; 28 3.81,2.286; 29 3.81,2.921; 30 3.81,3.581; 31 3.81,4.216; 32 3.81,4.877 | smd 4.115 x 4.369: 33 0,0
32005-201 = smd 3.1 x 0.5: 1 3,1.6; 2 3,0.8; 3 3,0; 4 3,-0.8; 5 3,-1.6 | smd 2.5 x 2: M1 -3,-4.45; M2 -3,4.45 | smd 3.3 x 2: M3 2.9,4.45; M4 2.9,-4.45 | hole 0.9: 0,2.2; 0,-2.2
HC49UP = smd 5.334 x 1.93: 1 -4.826,0; 2 4.826,0

### Placement (x,y rotation side)
C1  56.9,66.8 90 top
C2  61.98,66.8 90 top
C3  64.52,66.8 90 top
C4  69.6,66.8 90 top
C5  67.06,66.8 90 top
C6  72.14,66.8 90 top
C7  74.68,66.8 90 top
C8  30.23,66.8 90 top
C9  27.69,66.8 90 top
C10  32.77,66.8 90 top
C11  35.31,66.8 90 top
C12  40.39,66.8 90 top
C13  37.85,66.8 90 top
C14  42.93,66.8 90 top
C15  45.47,66.8 90 top
C16  46.99,-58.42 0 top  (outside the outline)
C17  102.87,-49.53 0 top  (outside the outline)
C18  109.22,-49.53 0 top  (outside the outline)
C19  115.57,-49.53 0 top  (outside the outline)
C20  59.44,66.8 90 top
C21  52.07,-58.42 0 top  (outside the outline)
C22  57.15,-58.42 0 top  (outside the outline)
C23  96.52,-49.53 0 top  (outside the outline)
C24  44.45,-102.87 0 top  (outside the outline)
C25  62.23,-58.42 0 top  (outside the outline)
C26  2.54,-58.42 0 top  (outside the outline)
C27  8.89,-58.42 0 top  (outside the outline)
C28  15.24,-58.42 0 top  (outside the outline)
C29  21.59,-58.42 0 top  (outside the outline)
C30  67.31,-58.42 0 top  (outside the outline)
C31  27.94,-58.42 0 top  (outside the outline)
C32  72.39,-58.42 0 top  (outside the outline)
C33  34.29,-58.42 0 top  (outside the outline)
C34  63.5,-50.8 0 top  (outside the outline)
C35  72.39,-50.8 0 top  (outside the outline)
C36  77.47,-58.42 0 top  (outside the outline)
C37  81.28,-50.8 0 top  (outside the outline)
C38  49.53,-102.87 0 top  (outside the outline)
C39  82.55,-58.42 0 top  (outside the outline)
C40  90.17,-50.8 0 top  (outside the outline)
C41  1n  [C0805']  43.18,-90.17 0 top  (outside the outline)
C42  1n  [C0805']  48.26,-90.17 0 top  (outside the outline)
C43  1n  [C0805']  53.34,-90.17 0 top  (outside the outline)
C44  1n  [C0805']  58.42,-90.17 0 top  (outside the outline)
C45  1n  [C0805']  63.5,-90.17 0 top  (outside the outline)
C46  1n  [C0805']  68.58,-90.17 0 top  (outside the outline)
C47  1n  [C0805']  73.66,-90.17 0 top  (outside the outline)
C48  1n  [C0805']  78.74,-90.17 0 top  (outside the outline)
C49  1n  [C0805']  83.82,-90.17 0 top  (outside the outline)
C50  1n  [C0805']  88.9,-90.17 0 top  (outside the outline)
C51  1n  [C0805']  93.98,-90.17 0 top  (outside the outline)
C52  1n  [C0805']  99.06,-90.17 0 top  (outside the outline)
C53  1n  [C0805']  104.14,-90.17 0 top  (outside the outline)
C54  1n  [C0805']  109.22,-90.17 0 top  (outside the outline)
C55  1n  [C0805']  114.3,-90.17 0 top  (outside the outline)
C56  1n  [C0805']  119.38,-90.17 0 top  (outside the outline)
C57  1n  [C0805']  2.54,-96.52 0 top  (outside the outline)
C58  1n  [C0805']  7.62,-96.52 0 top  (outside the outline)
C59  1n  [C0805']  12.7,-96.52 0 top  (outside the outline)
C60  1n  [C0805']  17.78,-96.52 0 top  (outside the outline)
C61  1n  [C0805']  22.86,-96.52 0 top  (outside the outline)
C62  1n  [C0805']  27.94,-96.52 0 top  (outside the outline)
C63  1n  [C0805']  33.02,-96.52 0 top  (outside the outline)
C64  1n  [C0805']  38.1,-96.52 0 top  (outside the outline)
C65  1n  [C0805']  43.18,-96.52 0 top  (outside the outline)
C66  1n  [C0805']  48.26,-96.52 0 top  (outside the outline)
C67  1n  [C0805']  53.34,-96.52 0 top  (outside the outline)
C68  1n  [C0805']  58.42,-96.52 0 top  (outside the outline)
C69  1n  [C0805']  63.5,-96.52 0 top  (outside the outline)
C70  1n  [C0805']  68.58,-96.52 0 top  (outside the outline)
C71  1n  [C0805']  73.66,-96.52 0 top  (outside the outline)
C72  1n  [C0805']  78.74,-96.52 0 top  (outside the outline)
C73  1n  [C0805']  83.82,-96.52 0 top  (outside the outline)
C74  1n  [C0805']  88.9,-96.52 0 top  (outside the outline)
C75  1n  [C0805']  93.98,-96.52 0 top  (outside the outline)
C76  1n  [C0805']  99.06,-96.52 0 top  (outside the outline)
C77  1n  [C0805']  104.14,-96.52 0 top  (outside the outline)
C78  1n  [C0805']  109.22,-96.52 0 top  (outside the outline)
C79  1n  [C0805']  114.3,-96.52 0 top  (outside the outline)
C80  1n  [C0805']  119.38,-96.52 0 top  (outside the outline)
C81  1n  [C0805']  2.54,-102.87 0 top  (outside the outline)
C82  1n  [C0805']  7.62,-102.87 0 top  (outside the outline)
C83  1n  [C0805']  12.7,-102.87 0 top  (outside the outline)
C84  1n  [C0805']  17.78,-102.87 0 top  (outside the outline)
C85  1n  [C0805']  22.86,-102.87 0 top  (outside the outline)
C86  1n  [C0805']  27.94,-102.87 0 top  (outside the outline)
C87  1n  [C0805']  33.02,-102.87 0 top  (outside the outline)
C88  1n  [C0805']  38.1,-102.87 0 top  (outside the outline)
C89  87.63,-58.42 0 top  (outside the outline)
C90  92.71,-58.42 0 top  (outside the outline)
C91  97.79,-58.42 0 top  (outside the outline)
C92  102.87,-58.42 0 top  (outside the outline)
C93  40.64,-58.42 0 top  (outside the outline)
C94  107.95,-58.42 0 top  (outside the outline)
C95  113.03,-58.42 0 top  (outside the outline)
C96  118.11,-58.42 0 top  (outside the outline)
C97  2.54,-64.77 0 top  (outside the outline)
C98  7.62,-64.77 0 top  (outside the outline)
D1  56.9,69.85 270 top
D2  59.44,69.85 270 top
D3  61.98,69.85 270 top
D4  64.52,69.85 270 top
D5  69.6,69.85 270 top
D6  67.06,69.85 270 top
D7  72.14,69.85 270 top
D8  74.68,69.85 270 top
D9  30.23,69.85 270 top
D10  27.69,69.85 270 top
D11  32.77,69.85 270 top
D12  35.31,69.85 270 top
D13  40.39,69.85 270 top
D14  37.85,69.85 270 top
D15  42.93,69.85 270 top
D16  45.47,69.85 270 top
D17  53.34,-102.87 0 top  (outside the outline)
D18  67.31,-102.87 0 top  (outside the outline)
D19  81.28,-102.87 0 top  (outside the outline)
D20  95.25,-102.87 0 top  (outside the outline)
D21  109.22,-102.87 0 top  (outside the outline)
D22  1.27,-109.22 0 top  (outside the outline)
D23  15.24,-109.22 0 top  (outside the outline)
D24  29.21,-109.22 0 top  (outside the outline)
D25  43.18,-109.22 0 top  (outside the outline)
D26  57.15,-109.22 0 top  (outside the outline)
D27  71.12,-109.22 0 top  (outside the outline)
D28  85.09,-109.22 0 top  (outside the outline)
D29  99.06,-109.22 0 top  (outside the outline)
D30  1.27,-114.3 0 top  (outside the outline)
D31  15.24,-114.3 0 top  (outside the outline)
D32  29.21,-114.3 0 top  (outside the outline)
D33  43.18,-114.3 0 top  (outside the outline)
D34  57.15,-114.3 0 top  (outside the outline)
D35  71.12,-114.3 0 top  (outside the outline)
D36  85.09,-114.3 0 top  (outside the outline)
D37  99.06,-114.3 0 top  (outside the outline)
D38  1.27,-119.38 0 top  (outside the outline)
D39  15.24,-119.38 0 top  (outside the outline)
D40  29.21,-119.38 0 top  (outside the outline)
D41  43.18,-119.38 0 top  (outside the outline)
D42  57.15,-119.38 0 top  (outside the outline)
D43  71.12,-119.38 0 top  (outside the outline)
D44  85.09,-119.38 0 top  (outside the outline)
D45  99.06,-119.38 0 top  (outside the outline)
D46  1.27,-124.46 0 top  (outside the outline)
D47  15.24,-124.46 0 top  (outside the outline)
D48  29.21,-124.46 0 top  (outside the outline)
D49  43.18,-124.46 0 top  (outside the outline)
D50  57.15,-124.46 0 top  (outside the outline)
D51  71.12,-124.46 0 top  (outside the outline)
D52  85.09,-124.46 0 top  (outside the outline)
D53  99.06,-124.46 0 top  (outside the outline)
D54  1.27,-129.54 0 top  (outside the outline)
D55  15.24,-129.54 0 top  (outside the outline)
D56  29.21,-129.54 0 top  (outside the outline)
D57  43.18,-129.54 0 top  (outside the outline)
D58  57.15,-129.54 0 top  (outside the outline)
D59  71.12,-129.54 0 top  (outside the outline)
D60  85.09,-129.54 0 top  (outside the outline)
D61  99.06,-129.54 0 top  (outside the outline)
D62  1.27,-134.62 0 top  (outside the outline)
D63  15.24,-134.62 0 top  (outside the outline)
D64  29.21,-134.62 0 top  (outside the outline)
IC1  25.4,-50.8 0 top  (outside the outline)
IC2  39.37,-50.8 0 top  (outside the outline)
IC3  31.75,-10.16 0 top  (outside the outline)
IC4  97.79,-41.91 0 top  (outside the outline)
IC5  7.62,-50.8 0 top  (outside the outline)
IC6  49.53,-50.8 0 top  (outside the outline)
IC7  21.59,-33.02 0 top  (outside the outline)
J1  76.2,-5.08 0 top
JP1  92.71,-7.62 0 top  (outside the outline)
LED0  43.18,-33.02 0 top  (outside the outline)
LED1  74.93,-33.02 0 top  (outside the outline)
LED2  106.68,-33.02 0 top  (outside the outline)
LED3  16.51,-43.18 0 top  (outside the outline)
Q1  56.9,60.2 0 top
Q2  59.44,57.4 0 top
Q3  61.98,60.2 0 top
Q4  64.52,57.4 0 top
Q5  69.6,57.4 0 top
Q6  67.06,60.2 0 top
Q7  72.14,60.2 0 top
Q8  74.68,57.4 0 top
Q9  30.23,57.4 0 top
Q10  27.69,60.2 0 top
Q11  32.77,60.2 0 top
Q12  35.31,57.4 0 top
Q13  40.39,57.4 0 top
Q14  37.85,60.2 0 top
Q15  42.93,60.2 0 top
Q16  45.47,57.4 0 top
Q17  57.15,-50.8 0 top  (outside the outline)
R1  56.9,63.75 270 top
R2  56.9,50.04 90 top
R3  56.9,53.09 270 top
R4  61.98,63.75 270 top
R5  61.98,50.04 90 top
R6  61.98,53.09 270 top
R7  64.52,63.75 270 top
R8  64.52,50.04 90 top
R9  64.52,53.09 270 top
R10  69.6,63.75 270 top
R11  69.6,50.04 90 top
R12  69.6,53.09 270 top
R13  67.06,63.75 270 top
R14  67.06,50.04 90 top
R15  67.06,53.09 270 top
R16  72.14,63.75 270 top
R17  72.14,50.04 90 top
R18  72.14,53.09 270 top
R19  74.68,63.75 270 top
R20  74.68,50.04 90 top
R21  74.68,53.09 270 top
R22  30.23,63.75 270 top
R23  30.23,50.04 90 top
R24  30.23,53.09 270 top
R25  27.69,63.75 270 top
R26  27.69,50.04 90 top
R27  27.69,53.09 270 top
R28  32.77,63.75 270 top
R29  32.77,50.04 90 top
R30  32.77,53.09 270 top
R31  35.31,63.75 270 top
R32  35.31,50.04 90 top
R33  35.31,53.09 270 top
R34  40.39,63.75 270 top
R35  40.39,50.04 90 top
R36  40.39,53.09 270 top
R37  37.85,63.75 270 top
R38  37.85,50.04 90 top
R39  37.85,53.09 270 top
R40  59.44,63.75 270 top
R41  59.44,50.04 90 top
R42  59.44,53.09 270 top
R43  42.93,63.75 270 top
R44  42.93,50.04 90 top
R45  42.93,53.09 270 top
R46  45.47,63.75 270 top
R47  45.47,50.04 90 top
R48  45.47,53.09 270 top
R49  21.59,-77.47 0 top  (outside the outline)
R50  27.94,-77.47 0 top  (outside the outline)
R51  34.29,-77.47 0 top  (outside the outline)
R52  40.64,-77.47 0 top  (outside the outline)
R53  46.99,-77.47 0 top  (outside the outline)
R54  53.34,-77.47 0 top  (outside the outline)
R55  12.7,-64.77 0 top  (outside the outline)
R56  24.13,-64.77 0 top  (outside the outline)
R57  59.69,-77.47 0 top  (outside the outline)
R58  66.04,-77.47 0 top  (outside the outline)
R59  72.39,-77.47 0 top  (outside the outline)
R60  78.74,-77.47 0 top  (outside the outline)
R61  85.09,-77.47 0 top  (outside the outline)
R62  90.17,-77.47 0 top  (outside the outline)
R63  95.25,-77.47 0 top  (outside the outline)
R64  100.33,-77.47 0 top  (outside the outline)
R65  105.41,-77.47 0 top  (outside the outline)
R66  110.49,-77.47 0 top  (outside the outline)
R67  115.57,-77.47 0 top  (outside the outline)
R68  2.54,-83.82 0 top  (outside the outline)
R69  7.62,-83.82 0 top  (outside the outline)
R70  12.7,-83.82 0 top  (outside the outline)
R71  17.78,-83.82 0 top  (outside the outline)
R72  22.86,-83.82 0 top  (outside the outline)
R73  27.94,-83.82 0 top  (outside the outline)
R74  33.02,-83.82 0 top  (outside the outline)
R75  38.1,-83.82 0 top  (outside the outline)
R76  43.18,-83.82 0 top  (outside the outline)
R77  48.26,-83.82 0 top  (outside the outline)
R78  53.34,-83.82 0 top  (outside the outline)
R79  58.42,-83.82 0 top  (outside the outline)
R80  63.5,-83.82 0 top  (outside the outline)
R81  68.58,-83.82 0 top  (outside the outline)
R82  73.66,-83.82 0 top  (outside the outline)
R83  78.74,-83.82 0 top  (outside the outline)
R84  83.82,-83.82 0 top  (outside the outline)
R85  88.9,-83.82 0 top  (outside the outline)
R86  93.98,-83.82 0 top  (outside the outline)
R87  99.06,-83.82 0 top  (outside the outline)
R88  104.14,-83.82 0 top  (outside the outline)
R89  109.22,-83.82 0 top  (outside the outline)
R90  114.3,-83.82 0 top  (outside the outline)
R91  119.38,-83.82 0 top  (outside the outline)
R92  2.54,-90.17 0 top  (outside the outline)
R93  7.62,-90.17 0 top  (outside the outline)
R94  12.7,-90.17 0 top  (outside the outline)
R95  17.78,-90.17 0 top  (outside the outline)
R96  22.86,-90.17 0 top  (outside the outline)
R97  27.94,-90.17 0 top  (outside the outline)
R98  33.02,-90.17 0 top  (outside the outline)
R99  38.1,-90.17 0 top  (outside the outline)
R100  35.56,-64.77 0 top  (outside the outline)
R101  41.91,-64.77 0 top  (outside the outline)
R102  48.26,-64.77 0 top  (outside the outline)
R103  54.61,-64.77 0 top  (outside the outline)
R104  60.96,-64.77 0 top  (outside the outline)
R105  67.31,-64.77 0 top  (outside the outline)
R106  73.66,-64.77 0 top  (outside the outline)
R107  80.01,-64.77 0 top  (outside the outline)
R108  86.36,-64.77 0 top  (outside the outline)
R109  92.71,-64.77 0 top  (outside the outline)
R110  78.74,-71.12 0 top  (outside the outline)
R111  15.24,-77.47 0 top  (outside the outline)
R112  85.09,-71.12 0 top  (outside the outline)
R113  91.44,-71.12 0 top  (outside the outline)
R114  97.79,-71.12 0 top  (outside the outline)
R115  104.14,-71.12 0 top  (outside the outline)
R116  110.49,-71.12 0 top  (outside the outline)
R117  116.84,-71.12 0 top  (outside the outline)
R118  2.54,-77.47 0 top  (outside the outline)
R119  8.89,-77.47 0 top  (outside the outline)
R120  99.06,-64.77 0 top  (outside the outline)
R121  105.41,-64.77 0 top  (outside the outline)
R122  111.76,-64.77 0 top  (outside the outline)
R123  118.11,-64.77 0 top  (outside the outline)
R124  2.54,-71.12 0 top  (outside the outline)
R125  8.89,-71.12 0 top  (outside the outline)
R126  15.24,-71.12 0 top  (outside the outline)
R127  21.59,-71.12 0 top  (outside the outline)
R128  27.94,-71.12 0 top  (outside the outline)
R129  34.29,-71.12 0 top  (outside the outline)
R130  40.64,-71.12 0 top  (outside the outline)
R131  46.99,-71.12 0 top  (outside the outline)
R132  53.34,-71.12 0 top  (outside the outline)
R133  59.69,-71.12 0 top  (outside the outline)
R134  66.04,-71.12 0 top  (outside the outline)
R135  72.39,-71.12 0 top  (outside the outline)
ROW1  64.77,74.93 0 top
ROW2  35.56,74.93 0 top
SG1  12.7,-15.24 0 top  (outside the outline)
TCH0  46.99,-43.18 0 top  (outside the outline)
TCH1  76.2,-43.18 0 top  (outside the outline)
U$1  106.68,-7.62 0 top
U$2  116.84,-7.62 0 top  (outside the outline)
X1  55.88,-7.62 0 top  (outside the outline)
XTAL1  7.62,-33.02 0 top  (outside the outline)

### Tracks (layer width: path | path; a pad name or v marks a point on that pad's centre or on a via)
+3V3  (28 unrouted)
+5V  (68 unrouted)
  Top 0.406: Q1.2 57.85,57.59 57.4,57.15 57.4,55.12 | 57.4,55.12 56.9,55.12 R3.1 | 57.4,55.12 59.44,55.12 | 60.45,55.12 61.98,55.12 | 62.48,55.12 62.48,57.15 62.99,57.66 62.99,59.03 Q3.2 | Q2.2 60.39,55.18 60.45,55.12 | 62.48,55.12 64.52,55.12 | Q4.2 65.53,56.24 65.53,55.12 64.52,55.12 | 60.45,55.12 59.44,55.12 | 59.44,55.12 R42.1 | 62.48,55.12 61.98,55.12 | 61.98,55.12 R6.1 | 64.52,55.12 R9.1 | Q6.2 68.01,57.59 67.56,57.15 67.56,55.12 | 67.56,55.12 67.06,55.12 R15.1 | 67.56,55.12 69.6,55.12 | 70.61,55.12 72.14,55.12 | 72.64,55.12 72.64,57.15 73.15,57.66 73.15,59.03 Q7.2 | Q5.2 70.55,55.18 70.61,55.12 | 72.64,55.12 74.68,55.12 | Q8.2 75.69,56.24 75.69,55.12 74.68,55.12 | 70.61,55.12 69.6,55.12 | 69.6,55.12 R12.1 | 72.64,55.12 72.14,55.12 | 72.14,55.12 R18.1 | 74.68,55.12 R21.1 | Q16.2 46.48,56.24 46.48,55.12 45.47,55.12 | Q15.2 43.94,59.03 43.94,57.66 43.43,57.15 43.43,55.12 | 45.47,55.12 R48.1 | 43.43,55.12 45.47,55.12 | Q13.2 41.34,55.18 41.4,55.12 | 43.43,55.12 42.93,55.12 | 42.93,55.12 R45.1 | 41.4,55.12 42.93,55.12 | Q14.2 38.8,57.59 38.35,57.15 38.35,55.12 | 41.4,55.12 40.39,55.12 | 40.39,55.12 R36.1 | 38.35,55.12 40.39,55.12 | 38.35,55.12 37.85,55.12 R39.1 | Q12.2 36.32,56.24 36.32,55.12 35.31,55.12 | Q11.2 33.78,59.03 33.78,57.66 33.27,57.15 33.27,55.12 | 35.31,55.12 R33.1 | 33.27,55.12 35.31,55.12 | Q9.2 31.18,55.18 31.24,55.12 | 33.27,55.12 32.77,55.12 | 32.77,55.12 R30.1 | 31.24,55.12 32.77,55.12 | Q10.2 28.64,57.59 28.19,57.15 28.19,55.12 | 31.24,55.12 30.23,55.12 | 30.23,55.12 R24.1 | 28.19,55.12 30.23,55.12 | 28.19,55.12 27.69,55.12 R27.1
AMSEL0  (2 unrouted)
AMSEL1  (2 unrouted)
B0  (3 unrouted)
B1  (3 unrouted)
B2  (3 unrouted)
B3  (3 unrouted)
B4  (3 unrouted)
B5  (3 unrouted)
B6  (3 unrouted)
B7  (3 unrouted)
B8  (3 unrouted)
B9  (3 unrouted)
B10  (3 unrouted)
B11  (3 unrouted)
B12  (3 unrouted)
B13  (3 unrouted)
B14  (3 unrouted)
B15  (3 unrouted)
C0_LAT  (1 unrouted)
C0_SCLK  (1 unrouted)
C0_SIN  (1 unrouted)
C0_SOUT  (1 unrouted)
C1_LAT  (1 unrouted)
C1_SCLK  (1 unrouted)
C1_SIN  (1 unrouted)
C1_SOUT  (1 unrouted)
C_BLANK  (2 unrouted)
CAIREF  (1 unrouted)
CAIREF1  (1 unrouted)
D+  (1 unrouted)
D-  (1 unrouted)
DISVREG  (1 unrouted)
G0  (3 unrouted)
G1  (3 unrouted)
G2  (3 unrouted)
G3  (3 unrouted)
G4  (3 unrouted)
G5  (3 unrouted)
G6  (3 unrouted)
G7  (3 unrouted)
G8  (3 unrouted)
G9  (3 unrouted)
G10  (3 unrouted)
G11  (3 unrouted)
G12  (3 unrouted)
G13  (3 unrouted)
G14  (3 unrouted)
G15  (3 unrouted)
GND  (131 unrouted)
  Top 0.406: 71.12,69.15 71.12,74.93 | D1.A C1.2 57.15,67.91 | D2.A C20.2 | D3.A C2.2 | D4.A C3.2 | 67.31,67.91 C5.2 D6.A | D5.A C4.2 | D7.A C6.2 | D8.A C7.2 | D16.A C15.2 | D15.A C14.2 | 41.91,69.15 41.91,74.93 | D13.A C12.2 | 38.1,67.91 C13.2 D14.A | D12.A C11.2 | D11.A C10.2 | D9.A C8.2 | D10.A C9.2 27.94,67.91
MCLR_  (2 unrouted)
N$1  (via drill 0.38)
  Top 0.406: R2.2 R3.2 58.17,53.51 v58.17,54.1 | Q1.1 55.95,58.86 v56.9,57.91
  Bottom 0.406: v56.9,57.91 58.17,56.64 v58.17,54.1
N$2
  Top 0.406: R1.1 C1.1
N$3  (via drill 0.38)
  Top 0.406: R5.2 R6.2 61.98,52.32 63.25,53.59 v63.25,54.1 | Q3.1 61.03,58.86 v61.98,57.91
  Bottom 0.406: v63.25,54.1 63.25,56.64 v61.98,57.91
N$4
  Top 0.406: R4.1 C2.1
N$5  (via drill 0.38)
  Top 0.406: R8.2 R9.2 64.52,52.32 65.79,53.59 v65.79,54.1 | v65.79,57.66 65.53,57.66 65.28,57.4 64.67,57.4 Q4.1
  Bottom 0.406: v65.79,54.1 v65.79,57.66
N$6
  Top 0.406: R7.1 C3.1
N$7  (via drill 0.38)
  Top 0.406: R11.2 R12.2 69.6,52.32 70.87,53.59 v70.87,54.1 | v70.87,57.66 70.61,57.66 70.36,57.4 69.75,57.4 Q5.1
  Bottom 0.406: v70.87,54.1 v70.87,57.66
N$8
  Top 0.406: C4.1 R10.1
N$9  (via drill 0.38)
  Top 0.406: R14.2 R15.2 68.33,53.51 v68.33,54.1 | Q6.1 66.11,58.86 v67.06,57.91
  Bottom 0.406: v67.06,57.91 68.33,56.64 v68.33,54.1
N$10
  Top 0.406: R13.1 C5.1
N$11  (via drill 0.38)
  Top 0.406: R17.2 R18.2 72.14,52.32 73.41,53.59 v73.41,54.1 | Q7.1 71.19,58.86 v72.14,57.91
  Bottom 0.406: v73.41,54.1 73.41,56.64 v72.14,57.91
N$12
  Top 0.406: R16.1 C6.1
N$13  (via drill 0.38)
  Top 0.406: R20.2 R21.2 74.68,52.32 75.95,53.59 v75.95,54.1 | v75.95,57.66 75.69,57.66 75.44,57.4 74.83,57.4 Q8.1
  Bottom 0.406: v75.95,54.1 v75.95,57.66
N$14
  Top 0.406: R19.1 C7.1
N$15  (via drill 0.38)
  Top 0.406: Q9.1 30.38,57.4 30.99,57.4 31.24,57.66 v31.5,57.66 | v31.5,54.1 31.5,53.59 30.23,52.32 R24.2 R23.2
  Bottom 0.406: v31.5,54.1 v31.5,57.66
N$16
  Top 0.406: C8.1 R22.1
N$17  (via drill 0.38)
  Top 0.406: R26.2 R27.2 28.96,53.51 v28.96,54.1 | Q10.1 26.74,58.86 v27.69,57.91
  Bottom 0.406: v27.69,57.91 28.96,56.64 v28.96,54.1
N$18
  Top 0.406: R25.1 C9.1
N$19  (via drill 0.38)
  Top 0.406: R29.2 R30.2 32.77,52.32 34.04,53.59 v34.04,54.1 | Q11.1 31.82,58.86 v32.77,57.91
  Bottom 0.406: v34.04,54.1 34.04,56.64 v32.77,57.91
N$20
  Top 0.406: R28.1 C10.1
N$21  (via drill 0.38)
  Top 0.406: R32.2 R33.2 35.31,52.32 36.58,53.59 v36.58,54.1 | v36.58,57.66 36.32,57.66 36.07,57.4 35.46,57.4 Q12.1
  Bottom 0.406: v36.58,54.1 v36.58,57.66
N$22
  Top 0.406: R31.1 C11.1
N$23  (via drill 0.38)
  Top 0.406: R35.2 R36.2 40.39,52.32 41.66,53.59 v41.66,54.1 | v41.66,57.66 41.4,57.66 41.15,57.4 40.54,57.4 Q13.1
  Bottom 0.406: v41.66,54.1 v41.66,57.66
N$24
  Top 0.406: C12.1 R34.1
N$25  (via drill 0.38)
  Top 0.406: R38.2 R39.2 39.12,53.51 v39.12,54.1 | Q14.1 36.9,58.86 v37.85,57.91
  Bottom 0.406: v37.85,57.91 39.12,56.64 v39.12,54.1
N$26
  Top 0.406: R37.1 C13.1
N$27  (via drill 0.38)
  Top 0.406: R44.2 R45.2 42.93,52.32 44.2,53.59 v44.2,54.1 | Q15.1 41.98,58.86 v42.93,57.91
  Bottom 0.406: v44.2,54.1 44.2,56.64 v42.93,57.91
N$28
  Top 0.406: R43.1 C14.1
N$29  (via drill 0.38)
  Top 0.406: R47.2 R48.2 45.47,52.32 46.74,53.59 v46.74,54.1 | v46.74,57.66 46.48,57.66 46.23,57.4 45.62,57.4 Q16.1
  Bottom 0.406: v46.74,54.1 v46.74,57.66
N$30
  Top 0.406: R46.1 C15.1
N$31  (via drill 0.38)
  other vias: 68.33,54.1
N$32  (via drill 0.38)
  other vias: 70.87,54.1
N$33  (via drill 0.38)
  Top 0.406: R41.2 R42.2 59.44,52.32 60.71,53.59 v60.71,54.1 | v60.71,57.66 60.45,57.66 60.2,57.4 59.59,57.4 Q2.1
  Bottom 0.406: v60.71,54.1 v60.71,57.66
N$34
  Top 0.406: C20.1 R40.1
N$35  (via drill 0.38)
  other vias: 73.41,54.1
N$36  (via drill 0.38)
  other vias: 75.95,54.1
N$37  (via drill 0.38)
  other vias: 67.82,68.83
N$38  (via drill 0.38)
  other vias: 70.36,68.83
N$39  (via drill 0.38)
  other vias: 72.9,68.83
N$40  (via drill 0.38)
  other vias: 75.44,68.83
N$41  (2 unrouted)
N$42  (1 unrouted)
N$43  (2 unrouted)
N$44  (1 unrouted)
N$45  (1 unrouted)
N$46  (2 unrouted)
N$47  (1 unrouted)
N$48  (1 unrouted)
N$49  (via drill 0.38)
  other vias: 28.45,68.83
N$50  (via drill 0.38)
  other vias: 30.99,68.83
N$51  (via drill 0.38)
  other vias: 33.53,68.83
N$52  (via drill 0.38)
  other vias: 36.07,68.83
N$53  (via drill 0.38)
  other vias: 41.66,57.66
N$54  (via drill 0.38)
  other vias: 42.93,57.91
N$55  (via drill 0.38)
  other vias: 37.85,57.91
N$56  (via drill 0.38)
  other vias: 46.74,57.66
N$57  (via drill 0.38)
  other vias: 39.12,54.1
N$58  (via drill 0.38)
  other vias: 41.66,54.1
N$59  (via drill 0.38)
  other vias: 44.2,54.1
N$60  (via drill 0.38)
  other vias: 46.74,54.1
N$61  (via drill 0.38)
  other vias: 38.61,68.83
N$62  (via drill 0.38)
  other vias: 41.15,68.83
N$63  (via drill 0.38)
  other vias: 43.69,68.83
N$64  (via drill 0.38)
  other vias: 46.23,68.83
N$65  (1 unrouted)
N$66  (1 unrouted)
N$67  (1 unrouted)
N$68  (1 unrouted)
N$69  (1 unrouted)
N$70  (1 unrouted)
N$71  (1 unrouted)
N$72  (1 unrouted)
N$73  (1 unrouted)
N$74  (1 unrouted)
N$75  (1 unrouted)
N$76  (1 unrouted)
N$77  (1 unrouted)
N$78  (1 unrouted)
N$79  (1 unrouted)
N$80  (1 unrouted)
N$81  (1 unrouted)
N$82  (1 unrouted)
N$83  (1 unrouted)
N$84  (1 unrouted)
N$85  (1 unrouted)
N$86  (1 unrouted)
N$87  (1 unrouted)
N$88  (1 unrouted)
N$89  (1 unrouted)
N$90  (1 unrouted)
N$91  (1 unrouted)
N$92  (1 unrouted)
N$93  (1 unrouted)
N$94  (1 unrouted)
N$95  (1 unrouted)
N$96  (1 unrouted)
N$97  (1 unrouted)
N$98  (1 unrouted)
N$99  (1 unrouted)
N$100  (1 unrouted)
N$101  (1 unrouted)
N$102  (1 unrouted)
N$103  (1 unrouted)
N$104  (1 unrouted)
N$105  (1 unrouted)
N$106  (1 unrouted)
N$107  (1 unrouted)
N$108  (1 unrouted)
N$109  (1 unrouted)
N$110  (1 unrouted)
N$111  (1 unrouted)
N$112  (1 unrouted)
N$114  (1 unrouted)
N$116  (1 unrouted)
N$118  (1 unrouted)
N$120  (1 unrouted)
N$122  (1 unrouted)
N$124  (1 unrouted)
N$126  (1 unrouted)
N$128  (1 unrouted)
N$130  (1 unrouted)
N$132  (1 unrouted)
N$134  (1 unrouted)
N$136  (1 unrouted)
N$138  (1 unrouted)
N$140  (1 unrouted)
N$142  (1 unrouted)
N$144  (1 unrouted)
N$146  (1 unrouted)
N$148  (1 unrouted)
N$150  (1 unrouted)
N$152  (1 unrouted)
N$154  (1 unrouted)
N$156  (1 unrouted)
N$158  (1 unrouted)
N$160  (1 unrouted)
OSCI  (2 unrouted)
OSCO  (2 unrouted)
PGEC  (1 unrouted)
PGED  (1 unrouted)
R0  (3 unrouted)
R1  (3 unrouted)
R2  (3 unrouted)
R3  (3 unrouted)
R4  (3 unrouted)
R5  (3 unrouted)
R6  (3 unrouted)
R7  (3 unrouted)
R8  (3 unrouted)
R9  (3 unrouted)
R10  (3 unrouted)
R11  (3 unrouted)
R12  (3 unrouted)
R13  (3 unrouted)
R14  (3 unrouted)
R15  (3 unrouted)
RAEN  (2 unrouted)
RBEN  (2 unrouted)
ROW0
  Top 0.406: ROW1.1 55.88,70.45 | 55.88,70.45 D1.C | 55.88,70.45 55.88,63.92 R1.2 Q1.3
ROW0EN_  (1 unrouted)
ROW1
  Top 0.406: 58.42,70.45 58.42,63.92 R40.2 Q2.3 | D2.C 58.42,70.45 | ROW1.2 58.42,70.45
ROW1EN_  (1 unrouted)
ROW2
  Top 0.406: ROW1.3 60.96,70.45 | 60.96,70.45 60.96,63.92 R4.2 Q3.3 | D3.C 60.96,70.45
ROW2EN_  (1 unrouted)
ROW3
  Top 0.406: ROW1.4 63.5,70.36 | 63.5,70.36 63.5,63.92 R7.2 Q4.3 | D4.C 63.59,70.45 63.5,70.36
ROW3EN_  (1 unrouted)
ROW4  (1 unrouted)
  Top 0.406: D6.C 66.04,70.45 66.04,63.92 R13.2 Q6.3
ROW4EN_  (1 unrouted)
ROW5  (1 unrouted)
  Top 0.406: D5.C 68.58,70.45 68.58,63.92 R10.2 Q5.3
ROW5EN_  (1 unrouted)
ROW6  (1 unrouted)
  Top 0.406: D7.C 71.12,70.45 71.12,63.92 R16.2 Q7.3
ROW6EN_  (1 unrouted)
ROW7
  Top 0.406: Q8.3 R19.2 73.66,63.92 73.66,70.36 73.75,70.45 D8.C 73.66,70.45 ROW1.8
ROW7EN_  (1 unrouted)
ROW8
  Top 0.406: ROW2.1 26.67,70.45 | 26.67,70.45 D10.C | 26.67,70.45 26.67,63.92 R25.2 Q10.3
ROW8EN_  (1 unrouted)
ROW9
  Top 0.406: ROW2.3 31.75,70.45 | 31.75,70.45 31.75,63.92 R28.2 Q11.3 | D11.C 31.75,70.45
ROW9EN_  (1 unrouted)
ROW10
  Top 0.406: ROW2.4 34.29,70.36 | 34.29,70.36 34.29,63.92 R31.2 Q12.3 | D12.C 34.38,70.45 34.29,70.36
ROW10EN_  (1 unrouted)
ROW11  (1 unrouted)
  Top 0.406: D14.C 36.83,70.45 36.83,63.92 R37.2 Q14.3
ROW11EN_  (1 unrouted)
ROW12  (1 unrouted)
  Top 0.406: D15.C 41.91,70.45 41.91,63.92 R43.2 Q15.3
ROW12EN_  (1 unrouted)
ROW13
  Top 0.406: Q16.3 R46.2 44.45,63.92 44.45,70.36 44.54,70.45 D16.C 44.45,70.45 ROW2.8
ROW13EN_  (1 unrouted)
ROW14
  Top 0.406: 29.21,70.45 29.21,63.92 R22.2 Q9.3 | D9.C 29.21,70.45 | ROW2.2 29.21,70.45
ROW14EN_  (1 unrouted)
ROW15  (1 unrouted)
  Top 0.406: D13.C 39.37,70.45 39.37,63.92 R34.2 Q13.3
ROW15EN_  (1 unrouted)
RSEL0  (2 unrouted)
RSEL1  (2 unrouted)
RSEL2  (2 unrouted)
S$1
  Top 0.406: 66.04,69.15 66.04,74.93
S$2
  Top 0.406: 68.58,69.15 68.58,74.93
S$3
  Top 0.406: 36.83,69.15 36.83,74.93
S$4  (via drill 0.38)
  other vias: 61.98,57.91
S$5  (via drill 0.38)
  other vias: 60.71,54.1
S$6  (via drill 0.38)
  other vias: 65.79,57.66
S$7  (via drill 0.38)
  other vias: 65.79,54.1
S$8  (via drill 0.38)
  other vias: 58.17,54.1
S$9  (via drill 0.38)
  other vias: 63.25,54.1
S$10  (via drill 0.38)
  other vias: 60.71,57.66
S$11  (via drill 0.38)
  other vias: 56.9,57.91
S$12
  Top 0.406: 39.37,69.15 39.37,74.93
S$13  (via drill 0.38)
  other vias: 31.5,57.66
S$14  (via drill 0.38)
  other vias: 32.77,57.91
S$15
  Top 0.406: 67.06,49.28 67.31,49.28 67.31,49.53
S$16  (via drill 0.38)
  other vias: 27.69,57.91
S$17  (via drill 0.38)
  other vias: 36.58,57.66
S$18  (via drill 0.38)
  other vias: 28.96,54.1
S$19  (via drill 0.38)
  other vias: 31.5,54.1
S$20  (via drill 0.38)
  other vias: 34.04,54.1
S$21  (via drill 0.38)
  other vias: 36.58,54.1
S$22
  Top 0.406: 37.85,49.28 38.1,49.28 38.1,49.53
S$23  (via drill 0.38)
  other vias: 72.14,57.91
S$24  (via drill 0.38)
  other vias: 75.95,57.66
S$25  (via drill 0.38)
  other vias: 65.28,68.83
S$26  (via drill 0.38)
  other vias: 60.2,68.83
S$28  (via drill 0.38)
  other vias: 70.87,57.66
S$29  (via drill 0.38)
  other vias: 67.06,57.91
S$30  (via drill 0.38)
  other vias: 62.74,68.83
S$31  (via drill 0.38)
  other vias: 57.66,68.83
TMUX0  (1 unrouted)
TMUX1  (1 unrouted)
TMUX2  (1 unrouted)
TMUX3  (1 unrouted)
TOUCH0  (1 unrouted)
TOUCH1  (1 unrouted)
TOUCH2  (1 unrouted)
TOUCH3  (1 unrouted)
TOUCH4  (1 unrouted)
TOUCH5  (1 unrouted)
TOUCH6  (1 unrouted)
TOUCH7  (1 unrouted)
TOUCH8  (1 unrouted)
TOUCH9  (1 unrouted)
TOUCH10  (1 unrouted)
TOUCH11  (1 unrouted)
TOUCH12  (1 unrouted)
TOUCH13  (1 unrouted)
TOUCH14  (1 unrouted)
TOUCH15  (1 unrouted)
TOUCH16  (1 unrouted)
TOUCH17  (1 unrouted)
TOUCH18  (1 unrouted)
TOUCH19  (1 unrouted)
TOUCH20  (1 unrouted)
TOUCH21  (1 unrouted)
V+  (3 unrouted)
VBUS  (2 unrouted)
VDDCORE  (2 unrouted)
VREF+  (1 unrouted)